# Altium project SOM Board with RK3399.PrjPcb (part 1 of 4)
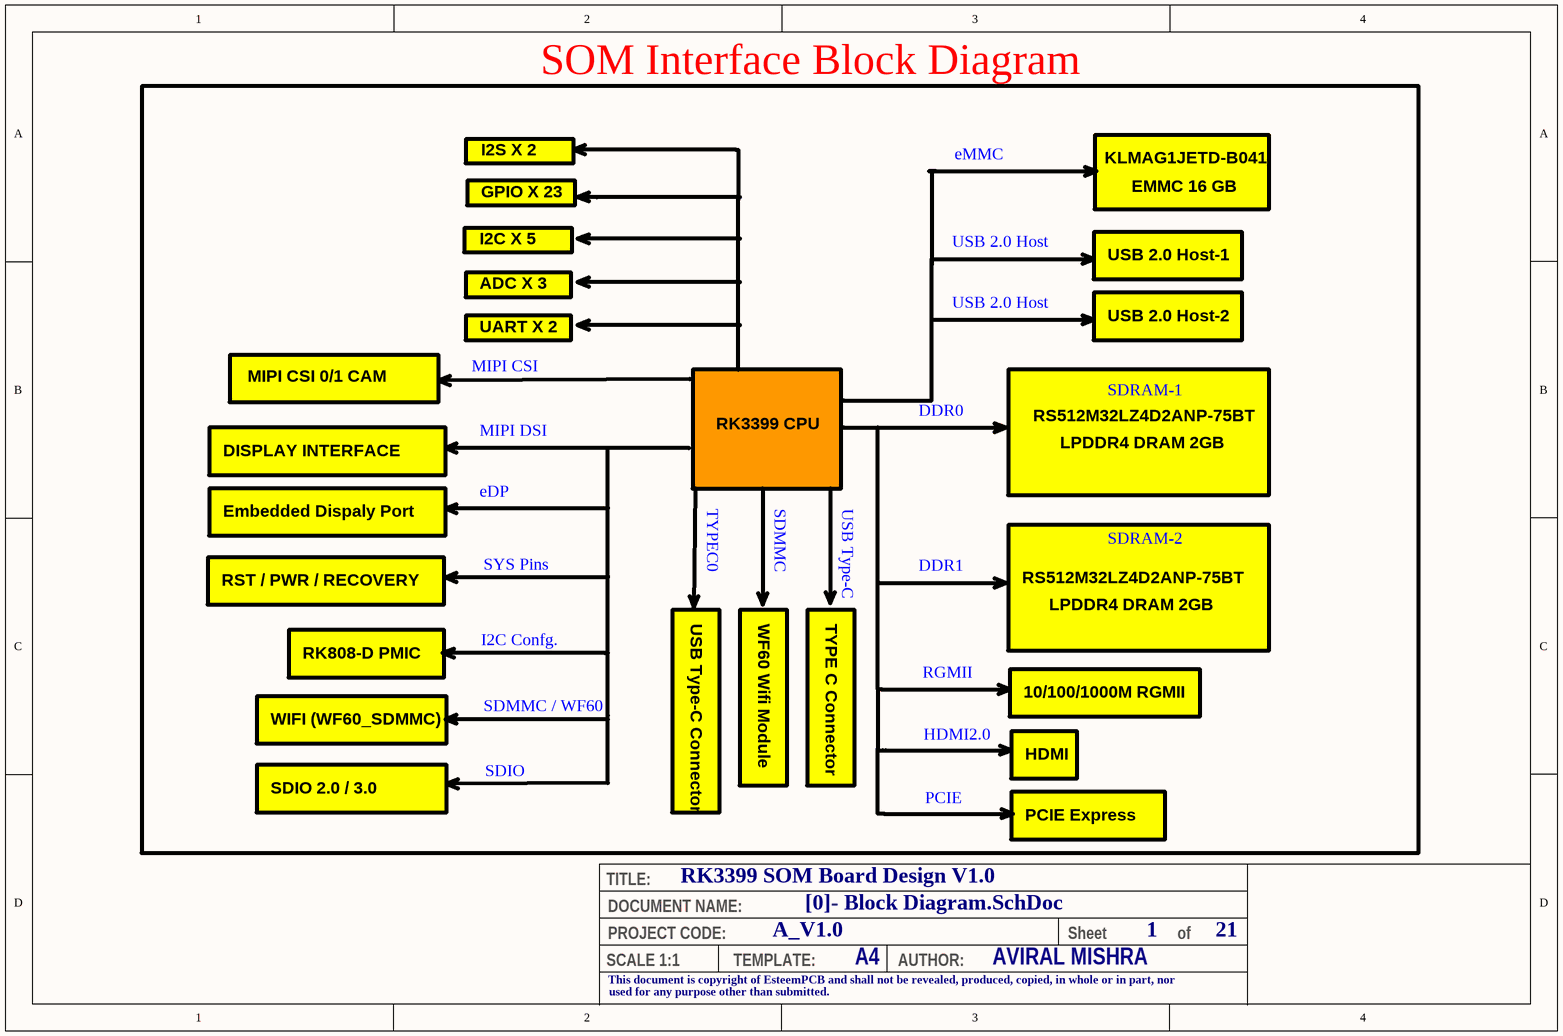
[diagram p0: [0]- Block Diagram.SchDoc]
21 sheets, 565 parts. Net scope: global (net labels, ports and power ports of the same name join across sheets).
Board file: SOM Board with RK3399.PcbDoc
Sheets:
  [0]- Block Diagram.SchDoc
  [0]-Power Blocks Diagram.SchDoc
  [1]-Power Pins Page of RK3399.SchDoc
  [2]-PMUIO_BLOCK.SchDoc
  [3]-RK3399_EMMC_ADC_PCIE.SchDoc
  [4]-RK3399 EDP_CSI_HDMI.SchDoc
  [5]-USB2, TYPEC, USIC.SchDoc
  [6]-MIPI-CSI_GPIOs and I2C.SchDoc
  [7]-RGMII_SDIO_SPI_GPIOs etc.SchDoc
  [8]-RK3399 SDRAM Page.SchDoc
  [9]-LPDDR4 SDRAM-1.SchDoc
  [10]-LPDDR4 SDRAM-2.SchDoc
  [11]-EMMC Chip.SchDoc
  [12]-WIFI Module WF60.SchDoc
  [13]-TYPEC0_PROG.SchDoc
  [14]-RGMII_PHY.SchDoc
  [15]-Push_Button_&_SYS_LED.SchDoc
  [16]-SP1_TYPEC_PWR_IN.SchDoc
  [17]-SP2_BUCKs_GPU_LOG_CPU-B.SchDoc
  [18]-SP3_PMIC_BLOCK.SchDoc
  [19]-DDR4_260_PIN_CON.SchDoc

## Sheet [0]- Block Diagram.SchDoc: RK3399 SOM Board Design V1.0
size A4; Author: AVIRAL MISHRA; DocumentNumber: 1; SheetNumber: 1; SheetTotal: 21; PROJECT CODE: A_V1.0

### Notes on the sheet
- SOM Interface Block Diagram
- I2S X 2
- eMMC
- KLMAG1JETD-B041
- I2C X 5
- GPIO X 23
- USB 2.0 Host
- EMMC 16 GB
- ADC X 3
- USB 2.0 Host-1
- MIPI CSI 0/1 CAM
- MIPI CSI
- UART X 2
- USB 2.0 Host-2
- MIPI DSI
- RK3399 CPU
- DDR0
- RS512M32LZ4D2ANP-75BT
- LPDDR4 DRAM 2GB
- SDRAM-1
- DISPLAY INTERFACE
- Embedded Dispaly Port
- eDP
- TYPEC0
- SDMMC
- USB Type-C
- RST / PWR / RECOVERY
- SYS Pins
- DDR1
- SDRAM-2
- I2C Confg.
- USB Type-C Connector
- WF60 Wifi Module
- TYPE C Connector
- RK808-D PMIC
- SDMMC / WF60
- RGMII
- 10/100/1000M RGMII
- WIFI (WF60_SDMMC)
- SDIO
- HDMI2.0
- HDMI
- SDIO 2.0 / 3.0
- PCIE
- PCIE Express
- TITLE:
- DOCUMENT NAME:
- SCALE 1:1
- This document is copyright of EsteemPCB and shall not be revealed, produced, copied, in whole or in part, nor
- PROJECT CODE:
- TEMPLATE:
- A4
- AUTHOR:
- Sheet
- of
- used for any purpose other than submitted.

## Sheet [0]-Power Blocks Diagram.SchDoc: RK3399 SOM Board Design V1.0
size A3; Author: ABC; Organization: Altium Limited; Address1: L3, 12a Rodborough Rd; Address2: Frenchs Forest; Address3: NSW; Address4: Australia 2086; DocumentNumber: 2; SheetNumber: 2; SheetTotal: 21; PROJECT CODE: A_V1.0
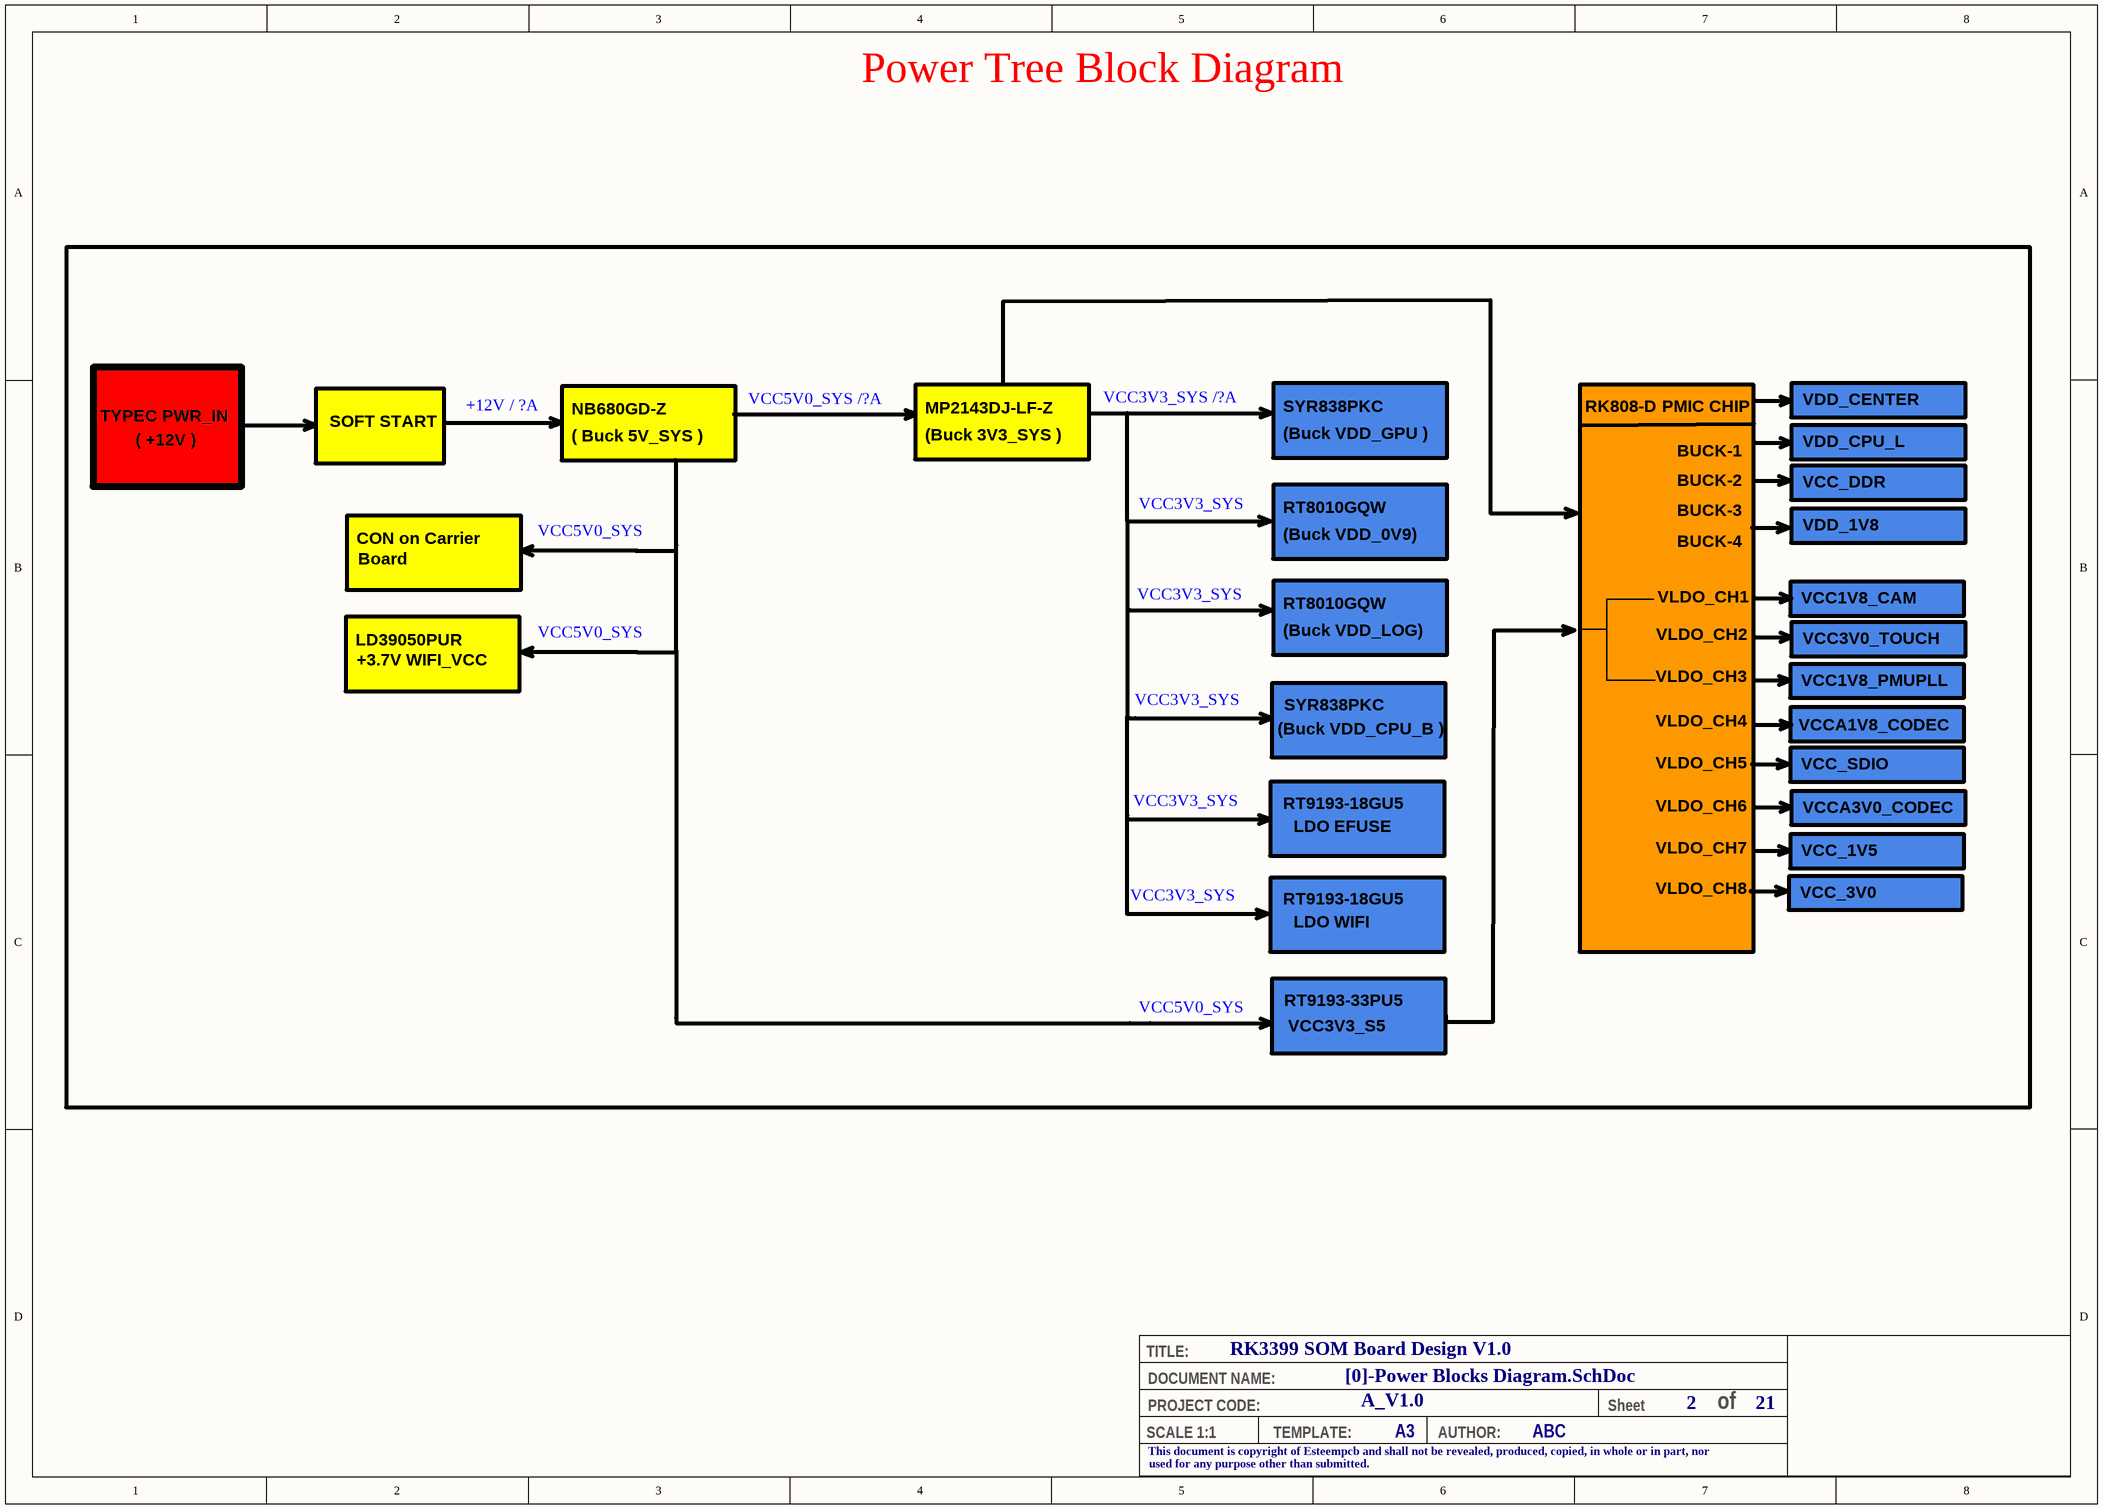
[diagram p1: [0]-Power Blocks Diagram.SchDoc]

### Notes on the sheet
- Power Tree Block Diagram
- TYPEC PWR_IN
- ( +12V )
- SOFT START
- +12V / ?A
- NB680GD-Z
- ( Buck 5V_SYS )
- VCC5V0_SYS /?A
- MP2143DJ-LF-Z
- (Buck 3V3_SYS )
- VCC3V3_SYS /?A
- SYR838PKC
- (Buck VDD_GPU )
- RK808-D
- PMIC CHIP
- VDD_CENTER
- VDD_CPU_L
- VCC3V3_SYS
- RT8010GQW
- BUCK-1
- BUCK-2
- BUCK-3
- VCC_DDR
- CON on Carrier
- Board
- VCC5V0_SYS
- (Buck VDD_0V9)
- BUCK-4
- VDD_1V8
- LD39050PUR
- (Buck VDD_LOG)
- VLDO_CH2
- VLDO_CH1
- VCC1V8_CAM
- VCC3V0_TOUCH
- +3.7V WIFI_VCC
- VLDO_CH3
- VCC1V8_PMUPLL
- (Buck VDD_CPU_B )
- VLDO_CH4
- VLDO_CH5
- VCCA1V8_CODEC
- VCC_SDIO
- RT9193-18GU5
- LDO EFUSE
- VLDO_CH6
- VLDO_CH7
- VCC_1V5
- VCCA3V0_CODEC
- VLDO_CH8
- VCC_3V0
- LDO WIFI
- RT9193-33PU5
- VCC3V3_S5
- TITLE:
- DOCUMENT NAME:
- SCALE 1:1
- This document is copyright of Esteempcb and shall not be revealed, produced, copied, in whole or in part, nor
- PROJECT CODE:
- TEMPLATE:
- A3
- AUTHOR:
- Sheet
- of
- used for any purpose other than submitted.

## Sheet [1]-Power Pins Page of RK3399.SchDoc: RK3399 SOM Board Design V1.0
size A3; Author: ABC; Organization: Altium Limited; Address1: L3, 12a Rodborough Rd; Address2: Frenchs Forest; Address3: NSW; Address4: Australia 2086; DocumentNumber: 3; SheetNumber: 3; SheetTotal: 21; PROJECT CODE: A_V1.0
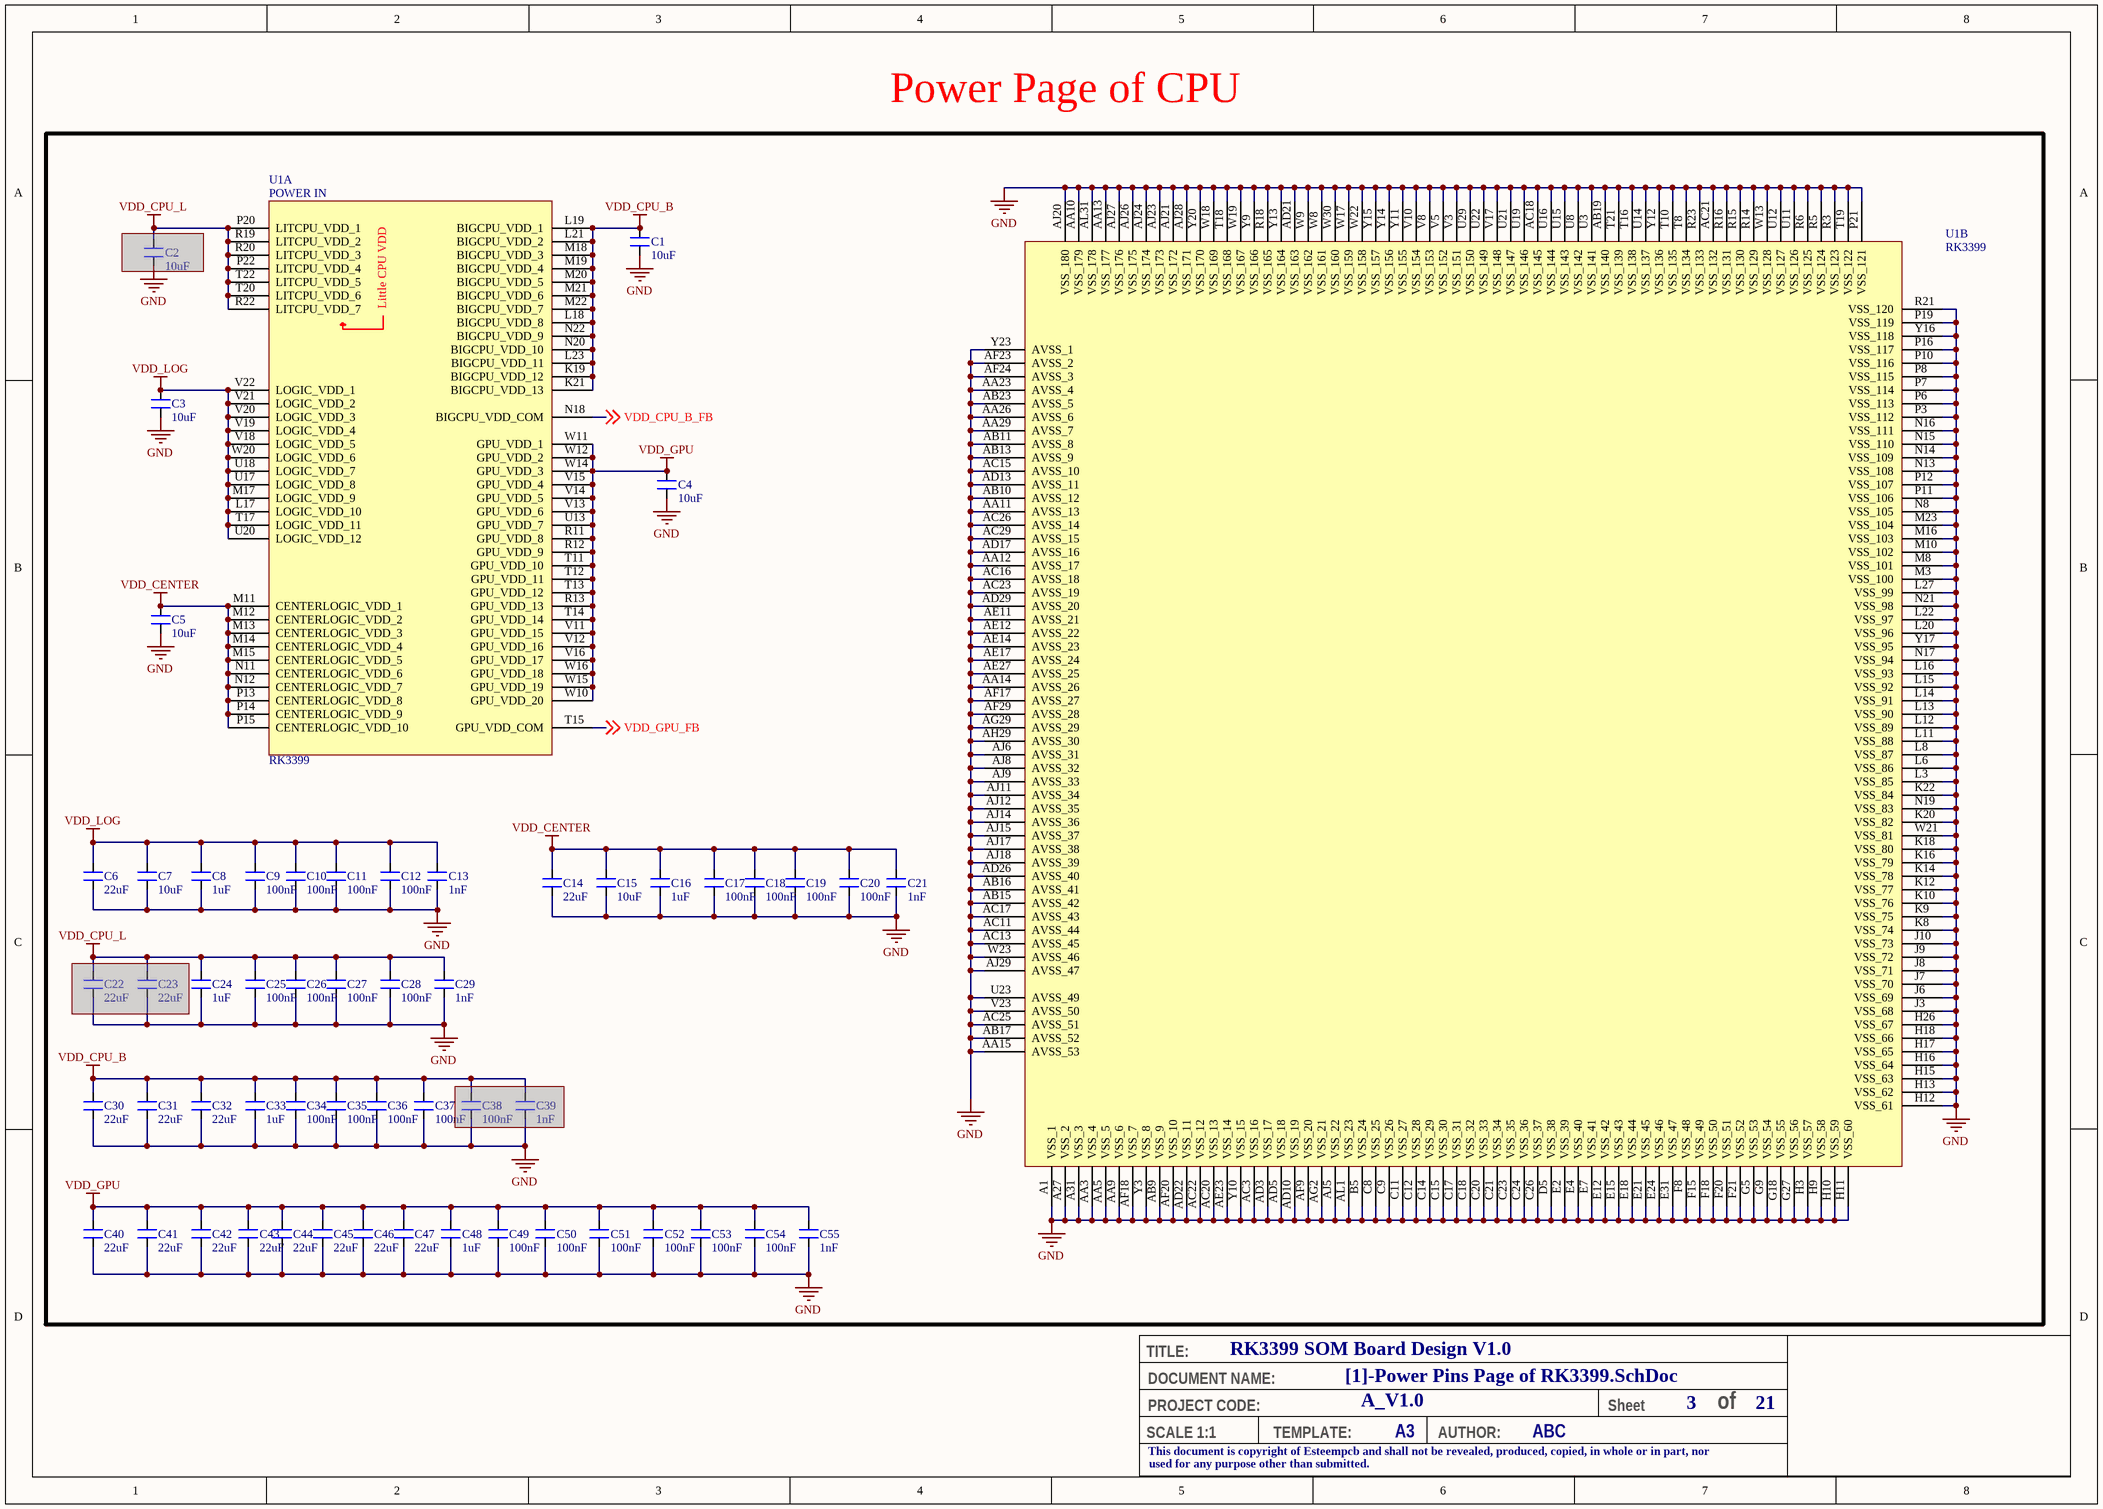
[diagram p2: [1]-Power Pins Page of RK3399.SchDoc]

### Parts
C1  10uF  [CAP_0402]
C2  10uF  [CAP_0402]  (masked out: inside a compile mask, not in the netlist)
C3  10uF  [CAP_0402]
C4  10uF  [CAP_0402]
C5  10uF  [CAP_0402]
C6  22uF  [CAP_0402]
C7  10uF  [CAP_0402]
C8  1uF  [CAP_0201]
C9  100nF  [CAP_0201]
C10  100nF  [CAP_0201]
C11  100nF  [CAP_0201]
C12  100nF  [CAP_0201]
C13  1nF  [CAP_0201]
C14  22uF  [CAP_0402]
C15  10uF  [CAP_0402]
C16  1uF  [CAP_0201]
C17  100nF  [CAP_0201]
C18  100nF  [CAP_0201]
C19  100nF  [CAP_0201]
C20  100nF  [CAP_0201]
C21  1nF  [CAP_0201]
C22  22uF  [CAP_0402]  (masked out: inside a compile mask, not in the netlist)
C23  22uF  [CAP_0402]  (masked out: inside a compile mask, not in the netlist)
C24  1uF  [CAP_0201]
C25  100nF  [CAP_0201]
C26  100nF  [CAP_0201]
C27  100nF  [CAP_0201]
C28  100nF  [CAP_0201]
C29  1nF  [CAP_0201]
C30  22uF  [CAP_0402]
C31  22uF  [CAP_0402]
C32  22uF  [CAP_0402]
C33  1uF  [CAP_0201]
C34  100nF  [CAP_0201]
C35  100nF  [CAP_0201]
C36  100nF  [CAP_0201]
C37  100nF  [CAP_0201]
C38  100nF  [CAP_0201]  (masked out: inside a compile mask, not in the netlist)
C39  1nF  [CAP_0201]  (masked out: inside a compile mask, not in the netlist)
C40  22uF  [CAP_0402]
C41  22uF  [CAP_0402]
C42  22uF  [CAP_0402]
C43  22uF  [CAP_0402]
C44  22uF  [CAP_0402]
C45  22uF  [CAP_0402]
C46  22uF  [CAP_0402]
C47  22uF  [CAP_0402]
C48  1uF  [CAP_0201]
C49  100nF  [CAP_0201]
C50  100nF  [CAP_0201]
C51  100nF  [CAP_0201]
C52  100nF  [CAP_0201]
C53  100nF  [CAP_0201]
C54  100nF  [CAP_0201]
C55  1nF  [CAP_0201]
U1  RK3399  [FBGA828_23_826X826]  (parts A,B of 24)

### Nets
GND: C1.1 C3.1 C4.1 C5.1 C6.1 C7.1 C8.1 C9.1 C10.1 C11.1 C12.1 C13.1 C14.1 C15.1 C16.1 C17.1 C18.1 C19.1 C20.1 C21.1 C24.1 C25.1 C26.1 C27.1 C28.1 C29.1 C30.1 C31.1 C32.1 C33.1 C34.1 C35.1 C36.1 C37.1 C40.1 C41.1 C42.1 C43.1 C44.1 C45.1 C46.1 C47.1 C48.1 C49.1 C50.1 C51.1 C52.1 C53.1 C54.1 C55.1 U1.A1(VSS_1) U1.A27(VSS_2) U1.A31(VSS_3) U1.AA3(VSS_4) U1.AA5(VSS_5) U1.AA9(VSS_6) U1.AA10(VSS_179) U1.AA11(AVSS_13) U1.AA12(AVSS_17) U1.AA13(VSS_177) U1.AA14(AVSS_26) U1.AA15(AVSS_53) U1.AA23(AVSS_4) U1.AA26(AVSS_6) U1.AA29(AVSS_7) U1.AB9(VSS_9) U1.AB10(AVSS_12) U1.AB11(AVSS_8) U1.AB13(AVSS_9) U1.AB15(AVSS_42) U1.AB16(AVSS_41) U1.AB17(AVSS_52) U1.AB19(VSS_140) U1.AB23(AVSS_5) U1.AC3(VSS_16) U1.AC11(AVSS_44) U1.AC13(AVSS_45) U1.AC15(AVSS_10) U1.AC16(AVSS_18) U1.AC17(AVSS_43) U1.AC18(VSS_145) U1.AC20(VSS_13) U1.AC21(VSS_132) U1.AC22(VSS_12) U1.AC23(AVSS_19) U1.AC25(AVSS_51) U1.AC26(AVSS_14) U1.AC29(AVSS_15) U1.AD3(VSS_17) U1.AD5(VSS_18) U1.AD10(VSS_19) U1.AD13(AVSS_11) U1.AD17(AVSS_16) U1.AD21(VSS_163) U1.AD22(VSS_11) U1.AD26(AVSS_40) U1.AD29(AVSS_20) U1.AE11(AVSS_21) U1.AE12(AVSS_22) U1.AE14(AVSS_23) U1.AE17(AVSS_24) U1.AE23(VSS_14) U1.AE27(AVSS_25) U1.AF9(VSS_20) U1.AF17(AVSS_27) U1.AF18(VSS_7) U1.AF20(VSS_10) U1.AF23(AVSS_2) U1.AF24(AVSS_3) U1.AF29(AVSS_28) U1.AG2(VSS_21) U1.AG29(AVSS_29) U1.AH29(AVSS_30) U1.AJ5(VSS_22) U1.AJ6(AVSS_31) U1.AJ8(AVSS_32) U1.AJ9(AVSS_33) U1.AJ11(AVSS_34) U1.AJ12(AVSS_35) U1.AJ14(AVSS_36) U1.AJ15(AVSS_37) U1.AJ17(AVSS_38) U1.AJ18(AVSS_39) U1.AJ20(VSS_180) U1.AJ21(VSS_172) U1.AJ23(VSS_173) U1.AJ24(VSS_174) U1.AJ26(VSS_175) U1.AJ27(VSS_176) U1.AJ28(VSS_171) U1.AJ29(AVSS_47) U1.AL1(VSS_23) U1.AL31(VSS_178) U1.B5(VSS_24) U1.C8(VSS_25) U1.C9(VSS_26) U1.C11(VSS_27) U1.C12(VSS_28) U1.C14(VSS_29) U1.C15(VSS_30) U1.C17(VSS_31) U1.C18(VSS_32) U1.C20(VSS_33) U1.C21(VSS_34) U1.C23(VSS_35) U1.C24(VSS_36) U1.C26(VSS_37) U1.D5(VSS_38) U1.E2(VSS_39) U1.E4(VSS_40) U1.E7(VSS_41) U1.E12(VSS_42) U1.E15(VSS_43) U1.E18(VSS_44) U1.E21(VSS_45) U1.E24(VSS_46) U1.E31(VSS_47) U1.F8(VSS_48) U1.F15(VSS_49) U1.F18(VSS_50) U1.F20(VSS_51) U1.F21(VSS_52) U1.G5(VSS_53) U1.G9(VSS_54) U1.G18(VSS_55) U1.G27(VSS_56) U1.H3(VSS_57) U1.H9(VSS_58) U1.H10(VSS_59) U1.H11(VSS_60) U1.H12(VSS_61) U1.H13(VSS_62) U1.H15(VSS_63) U1.H16(VSS_64) U1.H17(VSS_65) U1.H18(VSS_66) U1.H26(VSS_67) U1.J3(VSS_68) U1.J6(VSS_69) U1.J7(VSS_70) U1.J8(VSS_71) U1.J9(VSS_72) U1.J10(VSS_73) U1.K8(VSS_74) U1.K9(VSS_75) U1.K10(VSS_76) U1.K12(VSS_77) U1.K14(VSS_78) U1.K16(VSS_79) U1.K18(VSS_80) U1.K20(VSS_82) U1.K22(VSS_84) U1.L3(VSS_85) U1.L6(VSS_86) U1.L8(VSS_87) U1.L11(VSS_88) U1.L12(VSS_89) U1.L13(VSS_90) U1.L14(VSS_91) U1.L15(VSS_92) U1.L16(VSS_93) U1.L20(VSS_96) U1.L22(VSS_97) U1.L27(VSS_99) U1.M3(VSS_100) U1.M8(VSS_101) U1.M10(VSS_102) U1.M16(VSS_103) U1.M23(VSS_104) U1.N8(VSS_105) U1.N13(VSS_108) U1.N14(VSS_109) U1.N15(VSS_110) U1.N16(VSS_111) U1.N17(VSS_94) U1.N19(VSS_83) U1.N21(VSS_98) U1.P3(VSS_112) U1.P6(VSS_113) U1.P7(VSS_114) U1.P8(VSS_115) U1.P10(VSS_116) U1.P11(VSS_106) U1.P12(VSS_107) U1.P16(VSS_117) U1.P19(VSS_119) U1.P21(VSS_121) U1.R3(VSS_123) U1.R5(VSS_124) U1.R6(VSS_125) U1.R14(VSS_129) U1.R15(VSS_130) U1.R16(VSS_131) U1.R18(VSS_165) U1.R21(VSS_120) U1.R23(VSS_133) U1.T8(VSS_134) U1.T10(VSS_135) U1.T16(VSS_138) U1.T18(VSS_168) U1.T19(VSS_122) U1.T21(VSS_139) U1.U3(VSS_141) U1.U8(VSS_142) U1.U11(VSS_126) U1.U12(VSS_127) U1.U14(VSS_137) U1.U15(VSS_143) U1.U16(VSS_144) U1.U19(VSS_146) U1.U21(VSS_147) U1.U22(VSS_149) U1.U23(AVSS_49) U1.U29(VSS_150) U1.V3(VSS_151) U1.V5(VSS_152) U1.V8(VSS_153) U1.V10(VSS_154) U1.V17(VSS_148) U1.V23(AVSS_50) U1.W8(VSS_161) U1.W9(VSS_162) U1.W13(VSS_128) U1.W17(VSS_159) U1.W18(VSS_169) U1.W19(VSS_167) U1.W21(VSS_81) U1.W22(VSS_158) U1.W23(AVSS_46) U1.W30(VSS_160) U1.Y3(VSS_8) U1.Y9(VSS_166) U1.Y10(VSS_15) U1.Y11(VSS_155) U1.Y12(VSS_136) U1.Y13(VSS_164) U1.Y14(VSS_156) U1.Y15(VSS_157) U1.Y16(VSS_118) U1.Y17(VSS_95) U1.Y20(VSS_170) U1.Y23(AVSS_1)
VDD_CENTER: C5.2 C14.2 C15.2 C16.2 C17.2 C18.2 C19.2 C20.2 C21.2 U1.M11(CENTERLOGIC_VDD_1) U1.M12(CENTERLOGIC_VDD_2) U1.M13(CENTERLOGIC_VDD_3) U1.M14(CENTERLOGIC_VDD_4) U1.M15(CENTERLOGIC_VDD_5) U1.N11(CENTERLOGIC_VDD_6) U1.N12(CENTERLOGIC_VDD_7) U1.P13(CENTERLOGIC_VDD_8) U1.P14(CENTERLOGIC_VDD_9) U1.P15(CENTERLOGIC_VDD_10)
VDD_CPU_B: C1.2 C30.2 C31.2 C32.2 C33.2 C34.2 C35.2 C36.2 C37.2 U1.K19(BIGCPU_VDD_12) U1.K21(BIGCPU_VDD_13) U1.L18(BIGCPU_VDD_8) U1.L19(BIGCPU_VDD_1) U1.L21(BIGCPU_VDD_2) U1.L23(BIGCPU_VDD_11) U1.M18(BIGCPU_VDD_3) U1.M19(BIGCPU_VDD_4) U1.M20(BIGCPU_VDD_5) U1.M21(BIGCPU_VDD_6) U1.M22(BIGCPU_VDD_7) U1.N20(BIGCPU_VDD_10) U1.N22(BIGCPU_VDD_9)
VDD_CPU_L: C24.2 C25.2 C26.2 C27.2 C28.2 C29.2 U1.P20(LITCPU_VDD_1) U1.P22(LITCPU_VDD_4) U1.R19(LITCPU_VDD_2) U1.R20(LITCPU_VDD_3) U1.R22(LITCPU_VDD_7) U1.T20(LITCPU_VDD_6) U1.T22(LITCPU_VDD_5)
VDD_GPU: C4.2 C40.2 C41.2 C42.2 C43.2 C44.2 C45.2 C46.2 C47.2 C48.2 C49.2 C50.2 C51.2 C52.2 C53.2 C54.2 C55.2 U1.R11(GPU_VDD_8) U1.R12(GPU_VDD_9) U1.R13(GPU_VDD_13) U1.T11(GPU_VDD_10) U1.T12(GPU_VDD_11) U1.T13(GPU_VDD_12) U1.T14(GPU_VDD_14) U1.U13(GPU_VDD_7) U1.V11(GPU_VDD_15) U1.V12(GPU_VDD_16) U1.V13(GPU_VDD_6) U1.V14(GPU_VDD_5) U1.V15(GPU_VDD_4) U1.V16(GPU_VDD_17) U1.W10(GPU_VDD_20) U1.W11(GPU_VDD_1) U1.W12(GPU_VDD_2) U1.W14(GPU_VDD_3) U1.W15(GPU_VDD_19) U1.W16(GPU_VDD_18)
VDD_LOG: C3.2 C6.2 C7.2 C8.2 C9.2 C10.2 C11.2 C12.2 C13.2 U1.L17(LOGIC_VDD_10) U1.M17(LOGIC_VDD_9) U1.T17(LOGIC_VDD_11) U1.U17(LOGIC_VDD_8) U1.U18(LOGIC_VDD_7) U1.U20(LOGIC_VDD_12) U1.V18(LOGIC_VDD_5) U1.V19(LOGIC_VDD_4) U1.V20(LOGIC_VDD_3) U1.V21(LOGIC_VDD_2) U1.V22(LOGIC_VDD_1) U1.W20(LOGIC_VDD_6)
VDD_CPU_B_FB: U1.N18(BIGCPU_VDD_COM) ; off-sheet VDD_CPU_B_FB
VDD_GPU_FB: U1.T15(GPU_VDD_COM) ; off-sheet VDD_GPU_FB

### Notes on the sheet
- Power Page of CPU
- TITLE:
- DOCUMENT NAME:
- SCALE 1:1
- This document is copyright of Esteempcb and shall not be revealed, produced, copied, in whole or in part, nor
- PROJECT CODE:
- TEMPLATE:
- A3
- AUTHOR:
- Sheet
- of
- used for any purpose other than submitted.
- (in symbol IC_RK3399-FCBGA828, part A) POWER IN; Little CPU VDD

### Library data of the parts
C1-C5 C7 C15 = CAP_10uF-10V-20%-0402: 10µF ±20% 10V Ceramic Capacitor X5R 0402 (1005 Metric) /; Manufacturer Part Number: CL05A106MP5NUNC; Manufacturer: Samsung Electro-Mechanics; Case/Package: 0402; Supplier-1: Digikey
C6 C14 C22 C23 C30-C32 C40-C47 = CAP_22uF-6.3V-20%-0402: 22µF ±20% 6.3V Ceramic Capacitor X5R 0402 (1005 Metric) /; Manufacturer: Murata Electronics; Manufacturer Part Number: CL05A226MQ5N6J8; Case/Package: 0402; Supplier-1: Digikey
C8 C16 C24 C33 C48 = CAP_1uF-16V-10%-0201: 1µF ±20% 16V Ceramic Capacitor X5R 0201 (0603 Metric) /; Manufacturer: Samsung Electro-Mechanics; Manufacturer Part Number: CL03A105MO3NRNH; Case/Package: 0201; Supplier-1: Digikey
C9-C12 C17-C20 C25-C28 C34-C38 C49-C54 = CAP_100nF-25V-10%-0201: 0.1µF ±10% 25V Ceramic Capacitor X5R 0201 (0603 Metric) /; Manufacturer: TDK Corporation; Manufacturer Part Number: C0603X5R1E104K030BB; Case/Package: 0201; Supplier-1: Digikey
C13 C21 C29 C39 C55 = CAP_1nF-16V-10%-0201: 1000pF ±10% 16V Ceramic Capacitor X7R 0201 (0603 Metric) /; Manufacturer: Murata Electronics; Manufacturer Part Number: GRM033R71C102KA01D; Case/Package: 0201; Supplier-1: Digikey
U1 = IC_RK3399-FCBGA828: RK3399 is a low power, high performance processor for computing, personal mobile.; Manufacturer: Rockchip; Manufacturer Part Number: RK3399; Case/Package: FCBGA828; Supplier-1: Rockchip

## Sheet [2]-PMUIO_BLOCK.SchDoc: RK3399 SOM Board Design V1.0
size A4; Author: AVIRAL MISHRA; DocumentNumber: 4; SheetNumber: 4; SheetTotal: 21; PROJECT CODE: A_V1.0
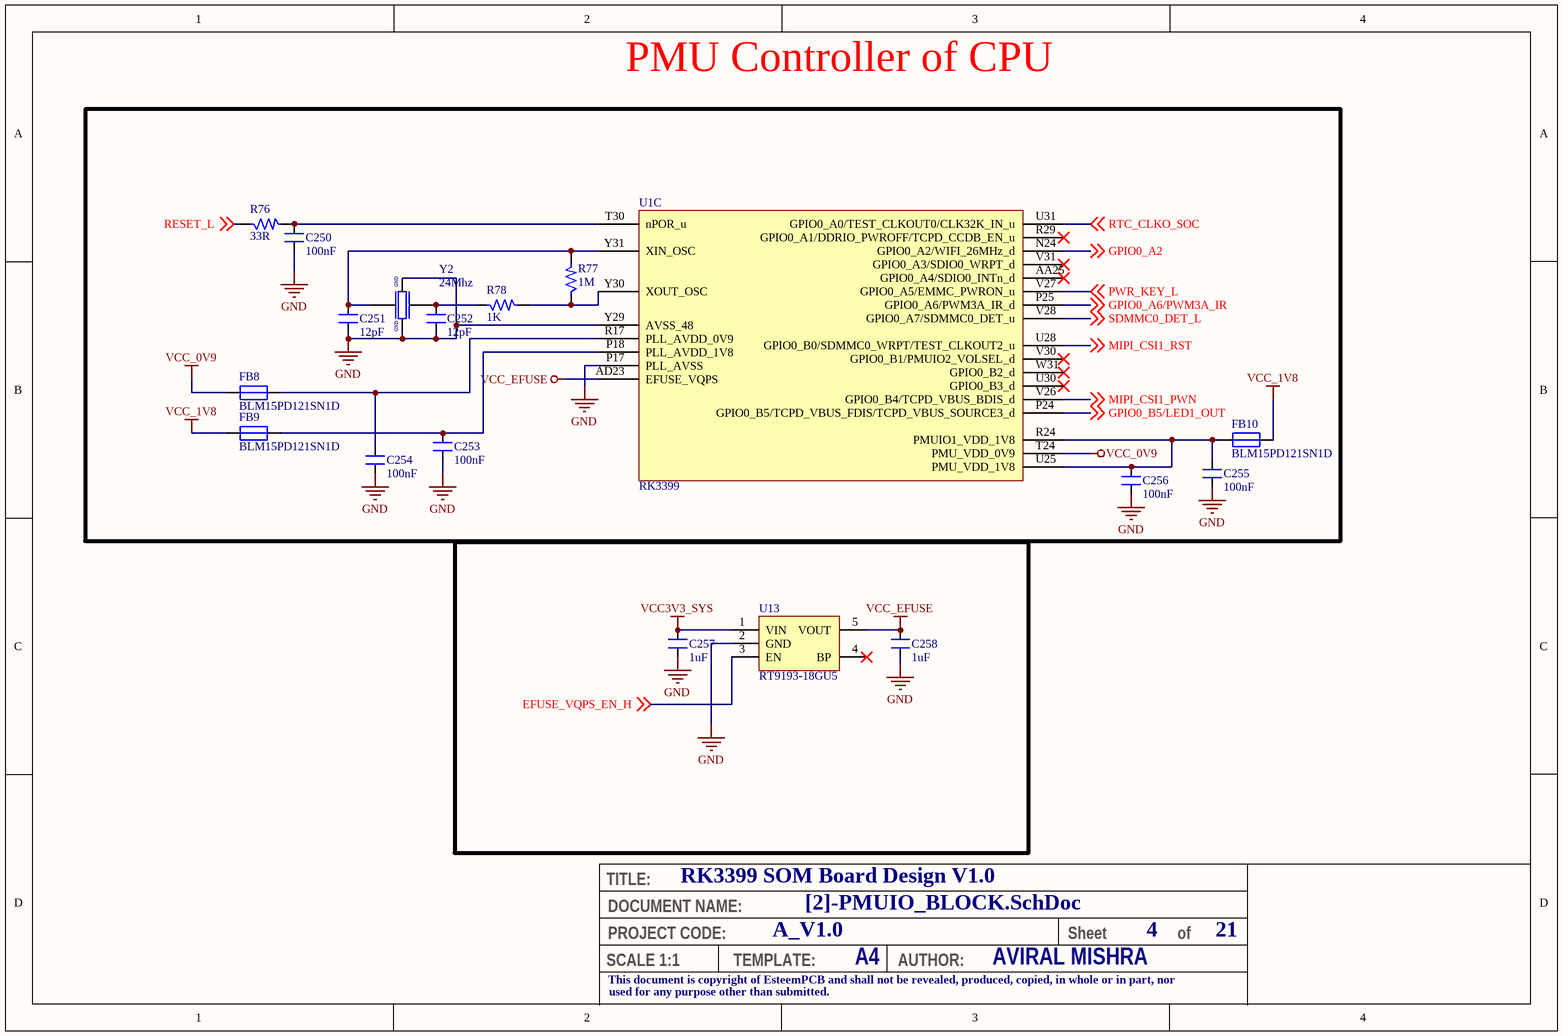
[diagram p3: [2]-PMUIO_BLOCK.SchDoc]

### Parts
C250  100nF  [CAP_0201]
C251  12pF  [CAP_0201]
C252  12pF  [CAP_0201]
C253  100nF  [CAP_0201]
C254  100nF  [CAP_0201]
C255  100nF  [CAP_0201]
C256  100nF  [CAP_0201]
C257  1uF  [CAP_0201]
C258  1uF  [CAP_0201]
FB8  BLM15PD121SN1D  [RES_0402]
FB9  BLM15PD121SN1D  [RES_0402]
FB10  BLM15PD121SN1D  [RES_0402]
R76  33R  [RES_0201]
R77  1M  [RES_0201]
R78  1K  [RES_0201]
U1  RK3399  [FBGA828_23_826X826]  (part C of 24)
U13  RT9193-18GU5  [SC70-5]
Y2  24Mhz  [XTAL_ABM8AIG-24.000MHZ-12-2Z-T3]

### Nets
GND: C250.1 C251.1 C252.1 C253.1 C254.1 C255.1 C256.1 C257.1 C258.1 U1.P17(PLL_AVSS) U1.Y29(AVSS_48) U13.2(GND) Y2.2 Y2.4
VCC3V3_SYS: C257.2 U13.1(VIN)
VCC_0V9: FB8.1 U1.T24(PMU_VDD_0V9)
VCC_1V8: FB9.1 FB10.2
VCC_EFUSE: C258.2 U1.AD23(EFUSE_VQPS) U13.5(VOUT)
EFUSE_VQPS_EN_H: U13.3(EN) ; off-sheet EFUSE_VQPS_EN_H
GPIO0_A2: U1.N24(GPIO0_A2/WIFI_26MHz_d) ; off-sheet GPIO0_A2
GPIO0_A6/PWM3A_IR: U1.P25(GPIO0_A6/PWM3A_IR_d) ; off-sheet GPIO0_A6/PWM3A_IR
GPIO0_B5/LED1_OUT: U1.P24(GPIO0_B5/TCPD_VBUS_FDIS/TCPD_VBUS_SOURCE3_d) ; off-sheet GPIO0_B5/LED1_OUT
MIPI_CSI1_PWN: U1.V26(GPIO0_B4/TCPD_VBUS_BDIS_d) ; off-sheet MIPI_CSI1_PWN
MIPI_CSI1_RST: U1.U28(GPIO0_B0/SDMMC0_WRPT/TEST_CLKOUT2_u) ; off-sheet MIPI_CSI1_RST
PWR_KEY_L: U1.V27(GPIO0_A5/EMMC_PWRON_u) ; off-sheet PWR_KEY_L
RESET_L: R76.1 ; off-sheet RESET_L
RTC_CLKO_SOC: U1.U31(GPIO0_A0/TEST_CLKOUT0/CLK32K_IN_u) ; off-sheet RTC_CLKO_SOC
SDMMC0_DET_L: U1.V28(GPIO0_A7/SDMMC0_DET_u) ; off-sheet SDMMC0_DET_L
NetC250_2: C250.2 R76.2 U1.T30(nPOR_u)
NetC251_2: C251.2 R77.2 U1.Y31(XIN_OSC) Y2.1
NetC252_2: C252.2 R78.1 Y2.3
NetC253_2: C253.2 FB9.2 U1.P18(PLL_AVDD_1V8)
NetC254_2: C254.2 FB8.2 U1.R17(PLL_AVDD_0V9)
NetC255_2: C255.2 C256.2 FB10.1 U1.R24(PMUIO1_VDD_1V8) U1.U25(PMU_VDD_1V8)
NetR77_1: R77.1 R78.2 U1.Y30(XOUT_OSC)

Not connected (* = marked no-connect by the designer): U1 AA25(GPIO0_A4/SDIO0_INTn_d)* R29(GPIO0_A1/DDRIO_PWROFF/TCPD_CCDB_EN_u)* U30(GPIO0_B3_d)* V30(GPIO0_B1/PMUIO2_VOLSEL_d)* V31(GPIO0_A3/SDIO0_WRPT_d)* W31(GPIO0_B2_d)*; U13 4(BP)*

### Notes on the sheet
- PMU Controller of CPU
- TITLE:
- DOCUMENT NAME:
- SCALE 1:1
- This document is copyright of EsteemPCB and shall not be revealed, produced, copied, in whole or in part, nor
- PROJECT CODE:
- TEMPLATE:
- A4
- AUTHOR:
- Sheet
- of
- used for any purpose other than submitted.
- (in symbol XTAL_24Mhz-12pF-4-SMD) GND

### Library data of the parts
C250 C253-C256 = CAP_100nF-25V-10%-0201: as C9 on sheet [1]-Power Pins Page of RK3399; Case/Package: 0201; Supplier-1: Digikey
C251 C252 = CAP_12pF-16V-10%-0201: 12pF ±10% 16V Ceramic Capacitor C0G, NP0 0201 (0603 Metric) /; Manufacturer: AVX Corporation; Manufacturer Part Number: 0201YA120KAT2A; Case/Package: 0201; Supplier-1: Digikey
C257 C258 = CAP_1uF-16V-10%-0201: as C8 on sheet [1]-Power Pins Page of RK3399; Case/Package: 0201; Supplier-1: Digikey
FB8-FB10 = FB_120R-1.3A-100Mhz-0402: 120 Ohms @ 100MHz 1 Power Line Ferrite Bead 0402 (1005 Metric) 1.3A 90mOhm; Manufacturer: Murata Electronics; Mnaufacturer Part Number: BLM15PD121SN1D; Case/Package: 0402; Supplier-1: Digikey
R76 = RES_33R-0.05W-1%-0201: 33 Ohms ±1% 0.05W, 1/20W Chip Resistor 0201 (0603 Metric) Thick Film /; Manufacturer: Yageo; Manufacturer Part Number: RC0201FR-0733RL; Case/Package: 0201; Supplier-1: Digikey
R77 = RES_1M-0.05W-1%-0201: 1 MOhms ±1% 0.05W, 1/20W Chip Resistor 0201 (0603 Metric) Thick Film /; Manufacturer: Yageo; Manufacturer Part Number: RC0201FR-071ML; Case/Package: 0201; Supplier-1: Digikey
R78 = RES_1K-0.05W-1%-0201: 1 kOhms ±1% 0.05W, 1/20W Chip Resistor 0201 (0603 Metric) Thick Film /; Manufacturer: Yageo; Manufacturer Part Number: RC0201FR-071KL; Case/Package: 0201; Supplier-1: Digikey
U1 = IC_RK3399-FCBGA828: as U1 on sheet [1]-Power Pins Page of RK3399; Manufacturer Part Number: RK3399; Case/Package: FCBGA828; Supplier-1: Rockchip
U13 = REG_1.8V-300mA-5.5V-SC70-5: Linear Voltage Regulator IC 1 Output 300mA SC-70-5; Manufacturer: Richtek USA Inc.; Manufacturer Part Number: RT9193-18GU5; Case/Package: SC70-5; Supplier-1: Digikey
Y2 = XTAL_24Mhz-12pF-4-SMD: 24MHz ±20ppm Crystal 12pF 50 Ohms 4-SMD, No Lead /; Manufacturer: Abracon LLC; Manufacturer Part Number: ABM8AIG-24.000MHZ-12-2Z-T3; Case/Package: SMD; Supplier-1: Digikey

## Sheet [3]-RK3399_EMMC_ADC_PCIE.SchDoc: RK3399 SOM Board Design V1.0
size A4; Author: AVIRAL MISHRA; DocumentNumber: 5; SheetNumber: 5; SheetTotal: 21; PROJECT CODE: A_V1.0
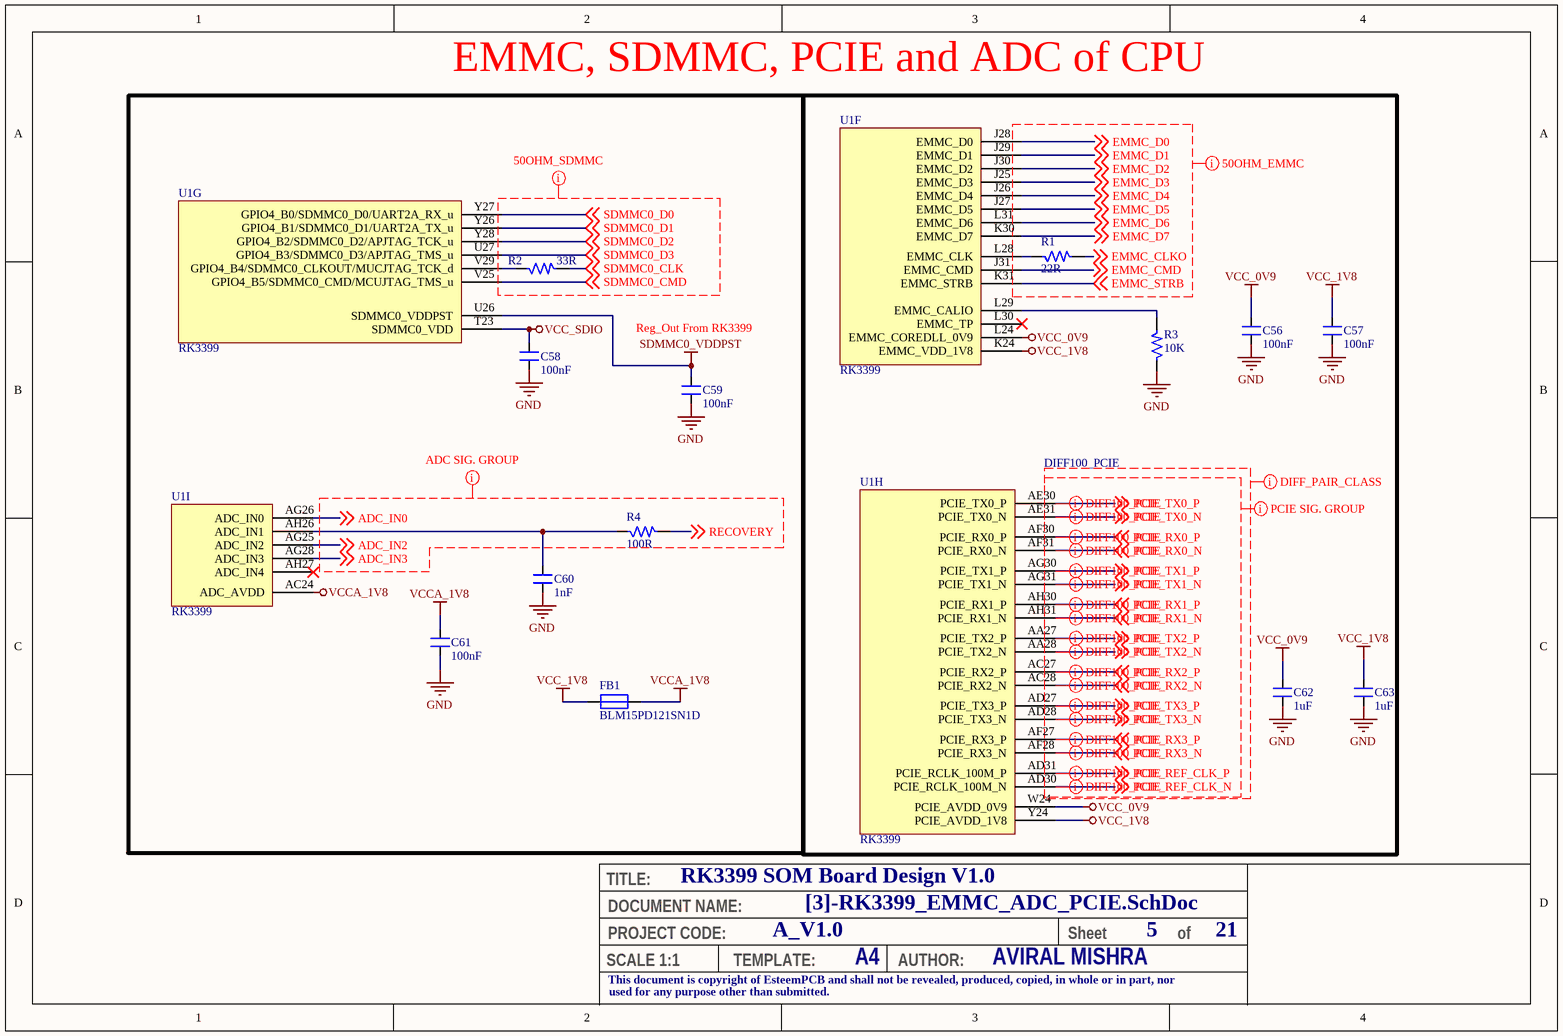
[diagram p4: [3]-RK3399_EMMC_ADC_PCIE.SchDoc]

### Parts
C56  100nF  [CAP_0201]
C57  100nF  [CAP_0201]
C58  100nF  [CAP_0201]
C59  100nF  [CAP_0201]
C60  1nF  [CAP_0201]
C61  100nF  [CAP_0201]
C62  1uF  [CAP_0201]
C63  1uF  [CAP_0201]
FB1  BLM15PD121SN1D  [RES_0402]
R1  22R  [RES_0201]
R2  33R  [RES_0201]
R3  10K  [RES_0201]
R4  100R  [RES_0201]
U1  RK3399  [FBGA828_23_826X826]  (parts F,G,H,I of 24)

### Blocks framed on the sheet
EMMC, SDMMC, PCIE and ADC of CPU: C58-C61 FB1 R2 R4 U1

### Nets
GND: C56.1 C57.1 C58.1 C59.1 C60.1 C61.1 C62.1 C63.1 R3.1
SDMMC0_VDDPST: C59.2 U1.U26(SDMMC0_VDDPST)
VCC_0V9: C56.2 C62.2 U1.L24(EMMC_COREDLL_0V9) U1.W24(PCIE_AVDD_0V9)
VCC_1V8: C57.2 C63.2 FB1.1 U1.K24(EMMC_VDD_1V8) U1.Y24(PCIE_AVDD_1V8)
VCC_SDIO: C58.2 U1.T23(SDMMC0_VDD)
VCCA_1V8: C61.2 FB1.2 U1.AC24(ADC_AVDD)
ADC_IN0: U1.AG26(ADC_IN0) ; off-sheet ADC_IN0
ADC_IN2: U1.AG25(ADC_IN2) ; off-sheet ADC_IN2
ADC_IN3: U1.AG28(ADC_IN3) ; off-sheet ADC_IN3
EMMC_CLKO: R1.2 ; off-sheet EMMC_CLKO
EMMC_CMD: U1.J31(EMMC_CMD) ; off-sheet EMMC_CMD
EMMC_D0: U1.J28(EMMC_D0) ; off-sheet EMMC_D0
EMMC_D1: U1.J29(EMMC_D1) ; off-sheet EMMC_D1
EMMC_D2: U1.J30(EMMC_D2) ; off-sheet EMMC_D2
EMMC_D3: U1.J25(EMMC_D3) ; off-sheet EMMC_D3
EMMC_D4: U1.J26(EMMC_D4) ; off-sheet EMMC_D4
EMMC_D5: U1.J27(EMMC_D5) ; off-sheet EMMC_D5
EMMC_D6: U1.L31(EMMC_D6) ; off-sheet EMMC_D6
EMMC_D7: U1.K30(EMMC_D7) ; off-sheet EMMC_D7
EMMC_STRB: U1.K31(EMMC_STRB) ; off-sheet EMMC_STRB
PCIE_REF_CLK_N: U1.AD30(PCIE_RCLK_100M_N) ; off-sheet PCIE_REF_CLK_N
PCIE_REF_CLK_P: U1.AD31(PCIE_RCLK_100M_P) ; off-sheet PCIE_REF_CLK_P
PCIE_RX0_N: U1.AF31(PCIE_RX0_N) ; off-sheet PCIE_RX0_N
PCIE_RX0_P: U1.AF30(PCIE_RX0_P) ; off-sheet PCIE_RX0_P
PCIE_RX1_N: U1.AH31(PCIE_RX1_N) ; off-sheet PCIE_RX1_N
PCIE_RX1_P: U1.AH30(PCIE_RX1_P) ; off-sheet PCIE_RX1_P
PCIE_RX2_N: U1.AC28(PCIE_RX2_N) ; off-sheet PCIE_RX2_N
PCIE_RX2_P: U1.AC27(PCIE_RX2_P) ; off-sheet PCIE_RX2_P
PCIE_RX3_N: U1.AF28(PCIE_RX3_N) ; off-sheet PCIE_RX3_N
PCIE_RX3_P: U1.AF27(PCIE_RX3_P) ; off-sheet PCIE_RX3_P
PCIE_TX0_N: U1.AE31(PCIE_TX0_N) ; off-sheet PCIE_TX0_N
PCIE_TX0_P: U1.AE30(PCIE_TX0_P) ; off-sheet PCIE_TX0_P
PCIE_TX1_N: U1.AG31(PCIE_TX1_N) ; off-sheet PCIE_TX1_N
PCIE_TX1_P: U1.AG30(PCIE_TX1_P) ; off-sheet PCIE_TX1_P
PCIE_TX2_N: U1.AA28(PCIE_TX2_N) ; off-sheet PCIE_TX2_N
PCIE_TX2_P: U1.AA27(PCIE_TX2_P) ; off-sheet PCIE_TX2_P
PCIE_TX3_N: U1.AD28(PCIE_TX3_N) ; off-sheet PCIE_TX3_N
PCIE_TX3_P: U1.AD27(PCIE_TX3_P) ; off-sheet PCIE_TX3_P
RECOVERY: R4.2 ; off-sheet RECOVERY
SDMMC0_CLK: R2.2 ; off-sheet SDMMC0_CLK
SDMMC0_CMD: U1.V25(GPIO4_B5/SDMMC0_CMD/MCUJTAG_TMS_u) ; off-sheet SDMMC0_CMD
SDMMC0_D0: U1.Y27(GPIO4_B0/SDMMC0_D0/UART2A_RX_u) ; off-sheet SDMMC0_D0
SDMMC0_D1: U1.Y26(GPIO4_B1/SDMMC0_D1/UART2A_TX_u) ; off-sheet SDMMC0_D1
SDMMC0_D2: U1.Y28(GPIO4_B2/SDMMC0_D2/APJTAG_TCK_u) ; off-sheet SDMMC0_D2
SDMMC0_D3: U1.U27(GPIO4_B3/SDMMC0_D3/APJTAG_TMS_u) ; off-sheet SDMMC0_D3
NetC60_2: C60.2 R4.1 U1.AH26(ADC_IN1)
NetR1_1: R1.1 U1.L28(EMMC_CLK)
NetR2_1: R2.1 U1.V29(GPIO4_B4/SDMMC0_CLKOUT/MUCJTAG_TCK_d)
NetR3_2: R3.2 U1.L29(EMMC_CALIO)

Not connected (* = marked no-connect by the designer): U1 AH27(ADC_IN4)* L30(EMMC_TP)*

### Layout directives
net class 50OHM_SDMMC: SDMMC0_CLK, SDMMC0_CMD, SDMMC0_D0, SDMMC0_D1, SDMMC0_D2, SDMMC0_D3
net class 50OHM_EMMC: EMMC_CLKO, EMMC_CMD, EMMC_D0, EMMC_D1, EMMC_D2, EMMC_D3, EMMC_D4, EMMC_D5, EMMC_D6, EMMC_D7, EMMC_STRB
net class PCIE SIG. GROUP: PCIE_REF_CLK_N, PCIE_REF_CLK_P, PCIE_RX0_N, PCIE_RX0_P, PCIE_RX1_N, PCIE_RX1_P, PCIE_RX2_N, PCIE_RX2_P, PCIE_RX3_N, PCIE_RX3_P, PCIE_TX0_N, PCIE_TX0_P, PCIE_TX1_N, PCIE_TX1_P, PCIE_TX2_N, PCIE_TX2_P, PCIE_TX3_N, PCIE_TX3_P
net class ADC SIG. GROUP: ADC_IN0, ADC_IN2, ADC_IN3, RECOVERY
differential pair; differential pair class DIFF100_PCIE: PCIE_REF_CLK_N, PCIE_REF_CLK_P, PCIE_RX0_N, PCIE_RX0_P, PCIE_RX1_N, PCIE_RX1_P, PCIE_RX2_N, PCIE_RX2_P, PCIE_RX3_N, PCIE_RX3_P, PCIE_TX0_N, PCIE_TX0_P, PCIE_TX1_N, PCIE_TX1_P, PCIE_TX2_N, PCIE_TX2_P, PCIE_TX3_N, PCIE_TX3_P
net class DIFF_PAIR_CLASS: PCIE_REF_CLK_N, PCIE_REF_CLK_P, PCIE_RX0_N, PCIE_RX0_P, PCIE_RX1_N, PCIE_RX1_P, PCIE_RX2_N, PCIE_RX2_P, PCIE_RX3_N, PCIE_RX3_P, PCIE_TX0_N, PCIE_TX0_P, PCIE_TX1_N, PCIE_TX1_P, PCIE_TX2_N, PCIE_TX2_P, PCIE_TX3_N, PCIE_TX3_P

### Notes on the sheet
- (near C59) Reg_Out From RK3399
- TITLE:
- DOCUMENT NAME:
- SCALE 1:1
- This document is copyright of EsteemPCB and shall not be revealed, produced, copied, in whole or in part, nor
- PROJECT CODE:
- TEMPLATE:
- A4
- AUTHOR:
- Sheet
- of
- used for any purpose other than submitted.

### Library data of the parts
C56-C59 C61 = CAP_100nF-25V-10%-0201: as C9 on sheet [1]-Power Pins Page of RK3399; Case/Package: 0201; Supplier-1: Digikey
C60 = CAP_1nF-16V-10%-0201: as C13 on sheet [1]-Power Pins Page of RK3399; Case/Package: 0201; Supplier-1: Digikey
C62 C63 = CAP_1uF-16V-10%-0201: as C8 on sheet [1]-Power Pins Page of RK3399; Case/Package: 0201; Supplier-1: Digikey
FB1 = FB_120R-1.3A-100Mhz-0402: as FB8 on sheet [2]-PMUIO_BLOCK; Mnaufacturer Part Number: BLM15PD121SN1D; Case/Package: 0402; Supplier-1: Digikey
R1 = RES_22R-0.05W-1%-0201: 22 Ohms ±1% 0.05W, 1/20W Chip Resistor 0201 (0603 Metric) Moisture Resistant Thick Film /; Manufacturer: Yageo; Manufacturer Part Number: RC0201FR-0722RL; Case/Package: 0201; Supplier-1: Digikey
R2 = RES_33R-0.05W-1%-0201: as R76 on sheet [2]-PMUIO_BLOCK; Case/Package: 0201; Supplier-1: Digikey
R3 = RES_10K-0.05W-1%-0201: 10 kOhms ±1% 0.05W, 1/20W Chip Resistor 0201 (0603 Metric) Thick Film /; Manufacturer: Stackpole Electronics Inc; Manufacturer Part Number: RMCF0201FT10K0; Case/Package: 0201; Supplier-1: Digikey
R4 = RES_100R-0.05W-1%-0201: 100 kOhms ±1% 0.05W, 1/20W Chip Resistor 0201 (0603 Metric) Automotive AEC-Q200 Thick Film /; Manufacturer: Panasonic Electronic Components; Manufacturer Part Number: ERJ-1GNF1003C; Case/Package: 0201; Supplier-1: Digikey
U1 = IC_RK3399-FCBGA828: as U1 on sheet [1]-Power Pins Page of RK3399; Manufacturer Part Number: RK3399; Case/Package: FCBGA828; Supplier-1: Rockchip

## Sheet [4]-RK3399 EDP_CSI_HDMI.SchDoc: RK3399 SOM Board Design V1.0
size A4; Author: AVIRAL MISHRA; DocumentNumber: 6; SheetNumber: 6; SheetTotal: 21; PROJECT CODE: A_V1.0
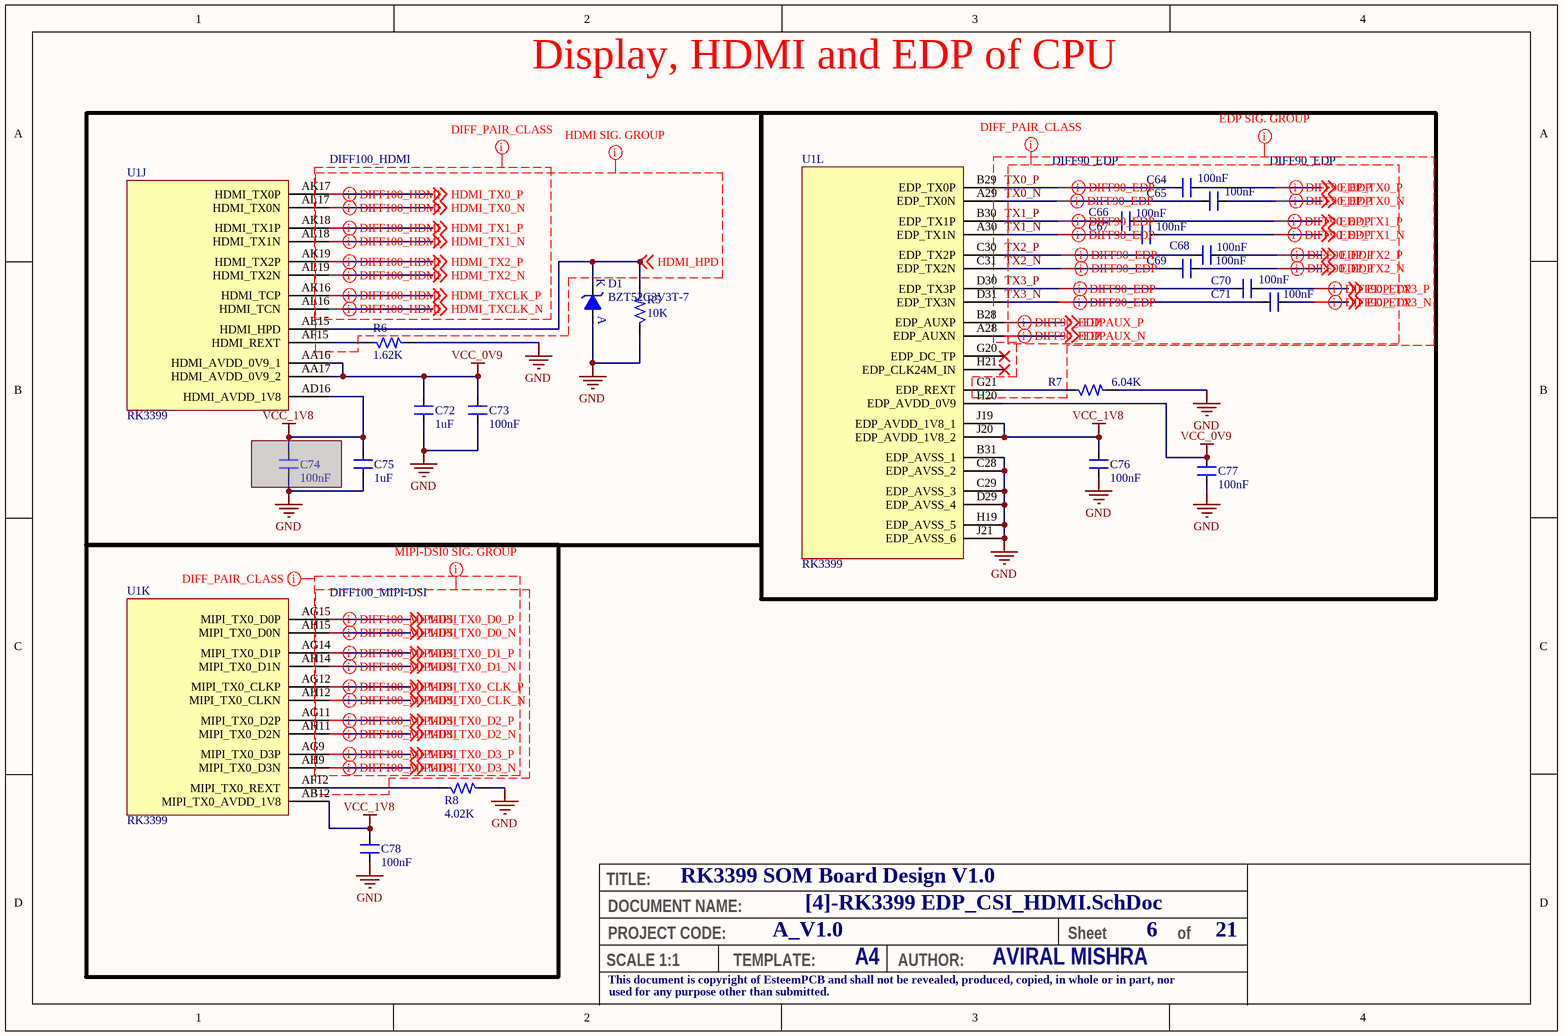
[diagram p5: [4]-RK3399 EDP_CSI_HDMI.SchDoc]

### Parts
C64  100nF  [CAP_0201]
C65  100nF  [CAP_0201]
C66  100nF  [CAP_0201]
C67  100nF  [CAP_0201]
C68  100nF  [CAP_0201]
C69  100nF  [CAP_0201]
C70  100nF  [CAP_0201]
C71  100nF  [CAP_0201]
C72  1uF  [CAP_0201]
C73  100nF  [CAP_0201]
C74  100nF  [CAP_0201]  (masked out: inside a compile mask, not in the netlist)
C75  1uF  [CAP_0201]
C76  100nF  [CAP_0201]
C77  100nF  [CAP_0201]
C78  100nF  [CAP_0201]
D1  BZT52C3V3T-7  [DIO_SOD523]
R5  10K  [RES_0201]
R6  1.62K  [RES_0201]
R7  6.04K  [RES_0201]
R8  4.02K  [RES_0201]
U1  RK3399  [FBGA828_23_826X826]  (parts J,K,L of 24)

### Nets
GND: C72.1 C73.1 C75.1 C76.2 C77.1 C78.1 D1.A R5.1 R6.2 R7.2 R8.2 U1.B31(EDP_AVSS_1) U1.C28(EDP_AVSS_2) U1.C29(EDP_AVSS_3) U1.D29(EDP_AVSS_4) U1.H19(EDP_AVSS_5) U1.J21(EDP_AVSS_6)
VCC_0V9: C72.2 C73.2 C77.2 U1.AA16(HDMI_AVDD_0V9_1) U1.AA17(HDMI_AVDD_0V9_2) U1.H20(EDP_AVDD_0V9)
VCC_1V8: C75.2 C76.1 C78.2 U1.AB12(MIPI_TX0_AVDD_1V8) U1.AD16(HDMI_AVDD_1V8) U1.J19(EDP_AVDD_1V8_1) U1.J20(EDP_AVDD_1V8_2)
EDP_TX0_N: C65.1 ; off-sheet EDP_TX0_N
EDP_TX0_P: C64.1 ; off-sheet EDP_TX0_P
EDP_TX1_N: C67.1 ; off-sheet EDP_TX1_N
EDP_TX1_P: C66.1 ; off-sheet EDP_TX1_P
EDP_TX2_N: C69.1 ; off-sheet EDP_TX2_N
EDP_TX2_P: C68.1 ; off-sheet EDP_TX2_P
EDP_TX3_N: C71.1 ; off-sheet EDP_TX3_N
EDP_TX3_P: C70.1 ; off-sheet EDP_TX3_P
EDPAUX_N: U1.A28(EDP_AUXN) ; off-sheet EDPAUX_N
EDPAUX_P: U1.B28(EDP_AUXP) ; off-sheet EDPAUX_P
HDMI_HPD: D1.K R5.2 U1.AE15(HDMI_HPD) ; off-sheet HDMI_HPD
HDMI_TX0_N: U1.AL17(HDMI_TX0N) ; off-sheet HDMI_TX0_N
HDMI_TX0_P: U1.AK17(HDMI_TX0P) ; off-sheet HDMI_TX0_P
HDMI_TX1_N: U1.AL18(HDMI_TX1N) ; off-sheet HDMI_TX1_N
HDMI_TX1_P: U1.AK18(HDMI_TX1P) ; off-sheet HDMI_TX1_P
HDMI_TX2_N: U1.AL19(HDMI_TX2N) ; off-sheet HDMI_TX2_N
HDMI_TX2_P: U1.AK19(HDMI_TX2P) ; off-sheet HDMI_TX2_P
HDMI_TXCLK_N: U1.AL16(HDMI_TCN) ; off-sheet HDMI_TXCLK_N
HDMI_TXCLK_P: U1.AK16(HDMI_TCP) ; off-sheet HDMI_TXCLK_P
MIPI_TX0_CLK_N: U1.AH12(MIPI_TX0_CLKN) ; off-sheet MIPI_TX0_CLK_N
MIPI_TX0_CLK_P: U1.AG12(MIPI_TX0_CLKP) ; off-sheet MIPI_TX0_CLK_P
MIPI_TX0_D0_N: U1.AH15(MIPI_TX0_D0N) ; off-sheet MIPI_TX0_D0_N
MIPI_TX0_D0_P: U1.AG15(MIPI_TX0_D0P) ; off-sheet MIPI_TX0_D0_P
MIPI_TX0_D1_N: U1.AH14(MIPI_TX0_D1N) ; off-sheet MIPI_TX0_D1_N
MIPI_TX0_D1_P: U1.AG14(MIPI_TX0_D1P) ; off-sheet MIPI_TX0_D1_P
MIPI_TX0_D2_N: U1.AH11(MIPI_TX0_D2N) ; off-sheet MIPI_TX0_D2_N
MIPI_TX0_D2_P: U1.AG11(MIPI_TX0_D2P) ; off-sheet MIPI_TX0_D2_P
MIPI_TX0_D3_N: U1.AH9(MIPI_TX0_D3N) ; off-sheet MIPI_TX0_D3_N
MIPI_TX0_D3_P: U1.AG9(MIPI_TX0_D3P) ; off-sheet MIPI_TX0_D3_P
TX0_N: C65.2 U1.A29(EDP_TX0N)
TX0_P: C64.2 U1.B29(EDP_TX0P)
TX1_N: C67.2 U1.A30(EDP_TX1N)
TX1_P: C66.2 U1.B30(EDP_TX1P)
TX2_N: C69.2 U1.C31(EDP_TX2N)
TX2_P: C68.2 U1.C30(EDP_TX2P)
TX3_N: C71.2 U1.D31(EDP_TX3N)
TX3_P: C70.2 U1.D30(EDP_TX3P)
NetR6_1: R6.1 U1.AF15(HDMI_REXT)
NetR7_1: R7.1 U1.G21(EDP_REXT)
NetR8_1: R8.1 U1.AF12(MIPI_TX0_REXT)

Not connected (* = marked no-connect by the designer): U1 G20(EDP_DC_TP)* H21(EDP_CLK24M_IN)*

### Layout directives
net class HDMI SIG. GROUP: HDMI_HPD, HDMI_TX0_N, HDMI_TX0_P, HDMI_TX1_N, HDMI_TX1_P, HDMI_TX2_N, HDMI_TX2_P, HDMI_TXCLK_N, HDMI_TXCLK_P
differential pair; differential pair class DIFF90_EDP: EDP_TX0_N, EDP_TX0_P, EDP_TX1_N, EDP_TX1_P, EDP_TX2_N, EDP_TX2_P, EDP_TX3_N, EDP_TX3_P, EDPAUX_N, EDPAUX_P, TX0_N, TX0_P, TX1_N, TX1_P, TX2_N, TX2_P, TX3_N, TX3_P
net class EDP SIG. GROUP: EDP_TX0_N, EDP_TX0_P, EDP_TX1_N, EDP_TX1_P, EDP_TX2_N, EDP_TX2_P, EDP_TX3_N, EDP_TX3_P, EDPAUX_N, EDPAUX_P, TX0_N, TX0_P, TX1_N, TX1_P, TX2_N, TX2_P, TX3_N, TX3_P
differential pair; differential pair class DIFF100_MIPI-DSI: MIPI_TX0_CLK_N, MIPI_TX0_CLK_P, MIPI_TX0_D0_N, MIPI_TX0_D0_P, MIPI_TX0_D1_N, MIPI_TX0_D1_P, MIPI_TX0_D2_N, MIPI_TX0_D2_P, MIPI_TX0_D3_N, MIPI_TX0_D3_P
net class MIPI-DSI0 SIG. GROUP: MIPI_TX0_CLK_N, MIPI_TX0_CLK_P, MIPI_TX0_D0_N, MIPI_TX0_D0_P, MIPI_TX0_D1_N, MIPI_TX0_D1_P, MIPI_TX0_D2_N, MIPI_TX0_D2_P, MIPI_TX0_D3_N, MIPI_TX0_D3_P
differential pair; differential pair class DIFF100_HDMI: HDMI_TX0_N, HDMI_TX0_P, HDMI_TX1_N, HDMI_TX1_P, HDMI_TX2_N, HDMI_TX2_P, HDMI_TXCLK_N, HDMI_TXCLK_P
net class DIFF_PAIR_CLASS: EDP_TX0_N, EDP_TX0_P, EDP_TX1_N, EDP_TX1_P, EDP_TX2_N, EDP_TX2_P, EDP_TX3_N, EDP_TX3_P, EDPAUX_N, EDPAUX_P, HDMI_TX0_N, HDMI_TX0_P, HDMI_TX1_N, HDMI_TX1_P, HDMI_TX2_N, HDMI_TX2_P, HDMI_TXCLK_N, HDMI_TXCLK_P, MIPI_TX0_CLK_N, MIPI_TX0_CLK_P, MIPI_TX0_D0_N, MIPI_TX0_D0_P, MIPI_TX0_D1_N, MIPI_TX0_D1_P, MIPI_TX0_D2_N, MIPI_TX0_D2_P, MIPI_TX0_D3_N, MIPI_TX0_D3_P

### Notes on the sheet
- Display, HDMI and EDP of CPU
- TITLE:
- DOCUMENT NAME:
- SCALE 1:1
- This document is copyright of EsteemPCB and shall not be revealed, produced, copied, in whole or in part, nor
- PROJECT CODE:
- TEMPLATE:
- A4
- AUTHOR:
- Sheet
- of
- used for any purpose other than submitted.

### Library data of the parts
C64-C71 C73 C74 C76-C78 = CAP_100nF-25V-10%-0201: as C9 on sheet [1]-Power Pins Page of RK3399; Case/Package: 0201; Supplier-1: Digikey
C72 C75 = CAP_1uF-16V-10%-0201: as C8 on sheet [1]-Power Pins Page of RK3399; Case/Package: 0201; Supplier-1: Digikey
D1 = DIO-Z_3.3V-300mW-SOD-523: Zener Diode 3.3V 300mW ±6% Surface Mount SOD-523 /; Manufacturer: Diodes Incorporated; Manufacturer Part Number: BZT52C3V3T-7; Case/Package: SOD523; Supplier-1: Digikey
R5 = RES_10K-0.05W-1%-0201: as R3 on sheet [3]-RK3399_EMMC_ADC_PCIE; Case/Package: 0201; Supplier-1: Digikey
R6 = RES_1.62K-0.05W-1%-0201: 1.62 kOhms ±1% 0.05W, 1/20W Chip Resistor 0201 (0603 Metric) Automotive AEC-Q200 Thick Film /; Manufacturer: Panasonic Electronic Components; Manufacturer Part Number: ERJ-1GNF1621C; Case/Package: 0201; Supplier-1: Digikey
R7 = RES_6.04K-0.05W-1%-0201: 6.04 kOhms ±1% 0.05W, 1/20W Chip Resistor 0201 (0603 Metric) Thick Film /; Manufacturer: Panasonic Electronic Components; Manufacturer Part Number: ERJ-1GEF6041C; Case/Package: 0201; Supplier-1: Digikey
R8 = RES_4.02K-0.05W-1%-0201: 4.02 kOhms ±1% 0.05W, 1/20W Chip Resistor 0201 (0603 Metric) Thick Film /; Manufacturer: Yageo; Manufacturer Part Number: RC0201FR-074K02L; Case/Package: 0201; Supplier-1: Digikey
U1 = IC_RK3399-FCBGA828: as U1 on sheet [1]-Power Pins Page of RK3399; Manufacturer Part Number: RK3399; Case/Package: FCBGA828; Supplier-1: Rockchip

## Sheet [5]-USB2, TYPEC, USIC.SchDoc: RK3399 SOM Board Design V1.0
size A4; Author: AVIRAL MISHRA; DocumentNumber: 7; SheetNumber: 7; SheetTotal: 21; PROJECT CODE: A_V1.0
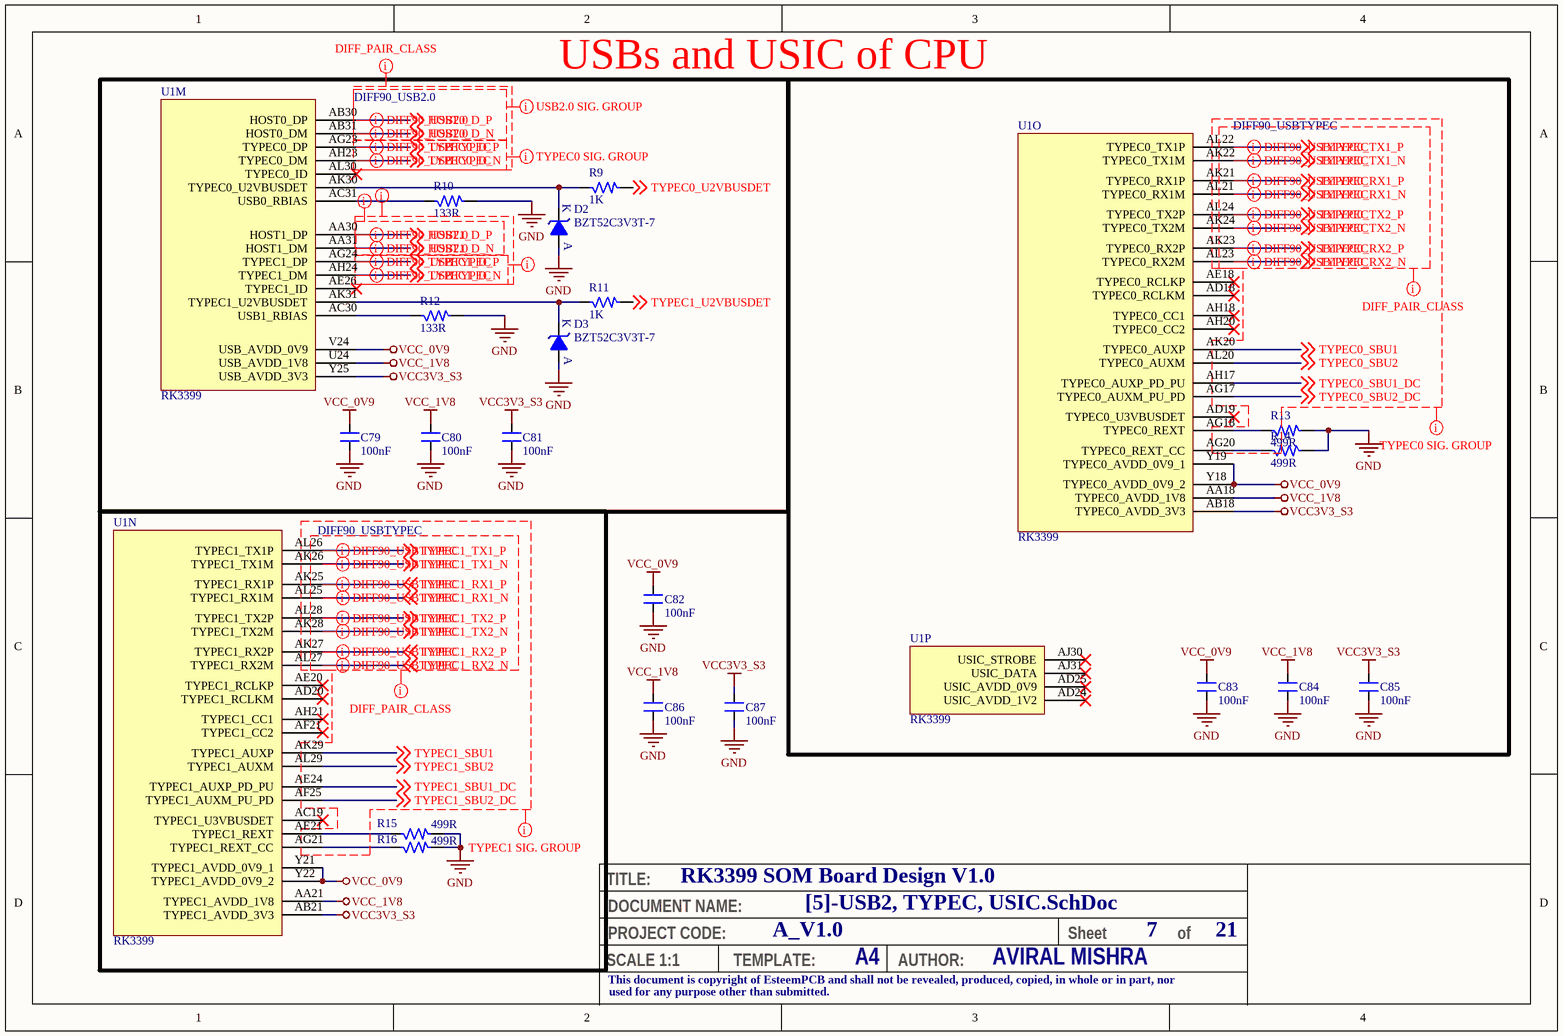
[diagram p6: [5]-USB2, TYPEC, USIC.SchDoc]

### Parts
C79  100nF  [CAP_0201]
C80  100nF  [CAP_0201]
C81  100nF  [CAP_0201]
C82  100nF  [CAP_0201]
C83  100nF  [CAP_0201]
C84  100nF  [CAP_0201]
C85  100nF  [CAP_0201]
C86  100nF  [CAP_0201]
C87  100nF  [CAP_0201]
D2  BZT52C3V3T-7  [DIO_SOD523]
D3  BZT52C3V3T-7  [DIO_SOD523]
R9  1K  [RES_0201]
R10  133R  [RES_0201]
R11  1K  [RES_0201]
R12  133R  [RES_0201]
R13  499R  [RES_0201]
R14  499R  [RES_0201]
R15  499R  [RES_0201]
R16  499R  [RES_0201]
U1  RK3399  [FBGA828_23_826X826]  (parts M,N,O,P of 24)

### Blocks framed on the sheet
USBs and USIC of CPU: C79-C81 D2 D3 R9-R12 U1

### Nets
GND: C79.2 C80.1 C81.1 C82.1 C83.1 C84.1 C85.1 C86.1 C87.1 D2.A D3.A R10.2 R12.2 R13.2 R14.2 R15.2 R16.2
VCC3V3_S3: C81.2 C85.2 C87.2 U1.AB18(TYPEC0_AVDD_3V3) U1.AB21(TYPEC1_AVDD_3V3) U1.Y25(USB_AVDD_3V3)
VCC_0V9: C79.1 C82.2 C83.2 U1.V24(USB_AVDD_0V9) U1.Y18(TYPEC0_AVDD_0V9_2) U1.Y19(TYPEC0_AVDD_0V9_1) U1.Y21(TYPEC1_AVDD_0V9_1) U1.Y22(TYPEC1_AVDD_0V9_2)
VCC_1V8: C80.2 C84.2 C86.2 U1.AA18(TYPEC0_AVDD_1V8) U1.AA21(TYPEC1_AVDD_1V8) U1.U24(USB_AVDD_1V8)
HOST0_D_N: U1.AB31(HOST0_DM) ; off-sheet HOST0_D_N
HOST0_D_P: U1.AB30(HOST0_DP) ; off-sheet HOST0_D_P
HOST1_D_N: U1.AA31(HOST1_DM) ; off-sheet HOST1_D_N
HOST1_D_P: U1.AA30(HOST1_DP) ; off-sheet HOST1_D_P
TYPEC0_D_N: U1.AH23(TYPEC0_DM) ; off-sheet TYPEC0_D_N
TYPEC0_D_P: U1.AG23(TYPEC0_DP) ; off-sheet TYPEC0_D_P
TYPEC0_RX1_N: U1.AL21(TYPEC0_RX1M) ; off-sheet TYPEC0_RX1_N
TYPEC0_RX1_P: U1.AK21(TYPEC0_RX1P) ; off-sheet TYPEC0_RX1_P
TYPEC0_RX2_N: U1.AL23(TYPEC0_RX2M) ; off-sheet TYPEC0_RX2_N
TYPEC0_RX2_P: U1.AK23(TYPEC0_RX2P) ; off-sheet TYPEC0_RX2_P
TYPEC0_SBU1: U1.AK20(TYPEC0_AUXP) ; off-sheet TYPEC0_SBU1
TYPEC0_SBU1_DC: U1.AH17(TYPEC0_AUXP_PD_PU) ; off-sheet TYPEC0_SBU1_DC
TYPEC0_SBU2: U1.AL20(TYPEC0_AUXM) ; off-sheet TYPEC0_SBU2
TYPEC0_SBU2_DC: U1.AG17(TYPEC0_AUXM_PU_PD) ; off-sheet TYPEC0_SBU2_DC
TYPEC0_TX1_N: U1.AK22(TYPEC0_TX1M) ; off-sheet TYPEC0_TX1_N
TYPEC0_TX1_P: U1.AL22(TYPEC0_TX1P) ; off-sheet TYPEC0_TX1_P
TYPEC0_TX2_N: U1.AK24(TYPEC0_TX2M) ; off-sheet TYPEC0_TX2_N
TYPEC0_TX2_P: U1.AL24(TYPEC0_TX2P) ; off-sheet TYPEC0_TX2_P
TYPEC0_U2VBUSDET: R9.2 ; off-sheet TYPEC0_U2VBUSDET
TYPEC1_D_N: U1.AH24(TYPEC1_DM) ; off-sheet TYPEC1_D_N
TYPEC1_D_P: U1.AG24(TYPEC1_DP) ; off-sheet TYPEC1_D_P
TYPEC1_RX1_N: U1.AL25(TYPEC1_RX1M) ; off-sheet TYPEC1_RX1_N
TYPEC1_RX1_P: U1.AK25(TYPEC1_RX1P) ; off-sheet TYPEC1_RX1_P
TYPEC1_RX2_N: U1.AL27(TYPEC1_RX2M) ; off-sheet TYPEC1_RX2_N
TYPEC1_RX2_P: U1.AK27(TYPEC1_RX2P) ; off-sheet TYPEC1_RX2_P
TYPEC1_SBU1: U1.AK29(TYPEC1_AUXP) ; off-sheet TYPEC1_SBU1
TYPEC1_SBU1_DC: U1.AE24(TYPEC1_AUXP_PD_PU) ; off-sheet TYPEC1_SBU1_DC
TYPEC1_SBU2: U1.AL29(TYPEC1_AUXM) ; off-sheet TYPEC1_SBU2
TYPEC1_SBU2_DC: U1.AF25(TYPEC1_AUXM_PU_PD) ; off-sheet TYPEC1_SBU2_DC
TYPEC1_TX1_N: U1.AK26(TYPEC1_TX1M) ; off-sheet TYPEC1_TX1_N
TYPEC1_TX1_P: U1.AL26(TYPEC1_TX1P) ; off-sheet TYPEC1_TX1_P
TYPEC1_TX2_N: U1.AK28(TYPEC1_TX2M) ; off-sheet TYPEC1_TX2_N
TYPEC1_TX2_P: U1.AL28(TYPEC1_TX2P) ; off-sheet TYPEC1_TX2_P
TYPEC1_U2VBUSDET: R11.2 ; off-sheet TYPEC1_U2VBUSDET
NetD2_K: D2.K R9.1 U1.AK30(TYPEC0_U2VBUSDET)
NetD3_K: D3.K R11.1 U1.AK31(TYPEC1_U2VBUSDET)
NetR10_1: R10.1 U1.AC31(USB0_RBIAS)
NetR12_1: R12.1 U1.AC30(USB1_RBIAS)
NetR13_1: R13.1 U1.AG18(TYPEC0_REXT)
NetR14_1: R14.1 U1.AG20(TYPEC0_REXT_CC)
NetR15_1: R15.1 U1.AE21(TYPEC1_REXT)
NetR16_1: R16.1 U1.AG21(TYPEC1_REXT_CC)

Not connected (* = marked no-connect by the designer): U1 AC19(TYPEC1_U3VBUSDET)* AD18(TYPEC0_RCLKM)* AD19(TYPEC0_U3VBUSDET)* AD20(TYPEC1_RCLKM)* AD24(USIC_AVDD_1V2)* AD25(USIC_AVDD_0V9)* AE18(TYPEC0_RCLKP)* AE20(TYPEC1_RCLKP)* AE26(TYPEC1_ID)* AF21(TYPEC1_CC2)* AH18(TYPEC0_CC1)* AH20(TYPEC0_CC2)* AH21(TYPEC1_CC1)* AJ30(USIC_STROBE)* AJ31(USIC_DATA)* AL30(TYPEC0_ID)*

### Layout directives
differential pair; differential pair class DIFF90_USB2.0: HOST0_D_N, HOST0_D_P, HOST1_D_N, HOST1_D_P
net class USB2.0 SIG. GROUP: HOST0_D_N, HOST0_D_P, HOST1_D_N, HOST1_D_P
differential pair; differential pair class DIFF90_USBTYPEC: TYPEC0_D_N, TYPEC0_D_P, TYPEC0_RX1_N, TYPEC0_RX1_P, TYPEC0_RX2_N, TYPEC0_RX2_P, TYPEC0_TX1_N, TYPEC0_TX1_P, TYPEC0_TX2_N, TYPEC0_TX2_P, TYPEC1_D_N, TYPEC1_D_P, TYPEC1_RX1_N, TYPEC1_RX1_P, TYPEC1_RX2_N, TYPEC1_RX2_P, TYPEC1_TX1_N, TYPEC1_TX1_P, TYPEC1_TX2_N, TYPEC1_TX2_P
net class TYPEC1 SIG. GROUP: TYPEC1_D_N, TYPEC1_D_P, TYPEC1_RX1_N, TYPEC1_RX1_P, TYPEC1_RX2_N, TYPEC1_RX2_P, TYPEC1_SBU1, TYPEC1_SBU1_DC, TYPEC1_SBU2, TYPEC1_SBU2_DC, TYPEC1_TX1_N, TYPEC1_TX1_P, TYPEC1_TX2_N, TYPEC1_TX2_P
net class TYPEC0 SIG. GROUP: TYPEC0_D_N, TYPEC0_D_P, TYPEC0_RX1_N, TYPEC0_RX1_P, TYPEC0_RX2_N, TYPEC0_RX2_P, TYPEC0_SBU1, TYPEC0_SBU1_DC, TYPEC0_SBU2, TYPEC0_SBU2_DC, TYPEC0_TX1_N, TYPEC0_TX1_P, TYPEC0_TX2_N, TYPEC0_TX2_P
net class DIFF_PAIR_CLASS: HOST0_D_N, HOST0_D_P, HOST1_D_N, HOST1_D_P, TYPEC0_D_N, TYPEC0_D_P, TYPEC0_RX1_N, TYPEC0_RX1_P, TYPEC0_RX2_N, TYPEC0_RX2_P, TYPEC0_TX1_N, TYPEC0_TX1_P, TYPEC0_TX2_N, TYPEC0_TX2_P, TYPEC1_D_N, TYPEC1_D_P, TYPEC1_RX1_N, TYPEC1_RX1_P, TYPEC1_RX2_N, TYPEC1_RX2_P, TYPEC1_TX1_N, TYPEC1_TX1_P, TYPEC1_TX2_N, TYPEC1_TX2_P

### Notes on the sheet
- TITLE:
- DOCUMENT NAME:
- SCALE 1:1
- This document is copyright of EsteemPCB and shall not be revealed, produced, copied, in whole or in part, nor
- PROJECT CODE:
- TEMPLATE:
- A4
- AUTHOR:
- Sheet
- of
- used for any purpose other than submitted.

### Library data of the parts
C79-C87 = CAP_100nF-25V-10%-0201: as C9 on sheet [1]-Power Pins Page of RK3399; Case/Package: 0201; Supplier-1: Digikey
D2 D3 = DIO-Z_3.3V-300mW-SOD-523: as D1 on sheet [4]-RK3399 EDP_CSI_HDMI; Manufacturer Part Number: BZT52C3V3T-7; Case/Package: SOD523; Supplier-1: Digikey
R9 R11 = RES_1K-0.05W-1%-0201: as R78 on sheet [2]-PMUIO_BLOCK; Case/Package: 0201; Supplier-1: Digikey
R10 R12 = RES_133R-0.05W-1%-0201: 133 Ohms ±1% 0.05W, 1/20W Chip Resistor 0201 (0603 Metric) Automotive AEC-Q200 Thick Film /; Manufacturer: Panasonic Electronic Components; Manufacturer Part Number: ERJ-1GNF1330C; Case/Package: 0201; Supplier-1: Digikey
R13-R16 = RES_499R-0.05W-1%-0201: 499 Ohms ±1% 0.05W, 1/20W Chip Resistor 0201 (0603 Metric) Thick Film /; Manufacturer: Stackpole Electronics Inc; Manufacturer Part Number: RMCF0201FT499R; Case/Package: 0201; Supplier-1: Digikey
U1 = IC_RK3399-FCBGA828: as U1 on sheet [1]-Power Pins Page of RK3399; Manufacturer Part Number: RK3399; Case/Package: FCBGA828; Supplier-1: Rockchip

## Sheet [6]-MIPI-CSI_GPIOs and I2C.SchDoc: RK3399 SOM Board Design V1.0
size A4; Author: AVIRAL MISHRA; DocumentNumber: 8; SheetNumber: 8; SheetTotal: 21; PROJECT CODE: A_V1.0
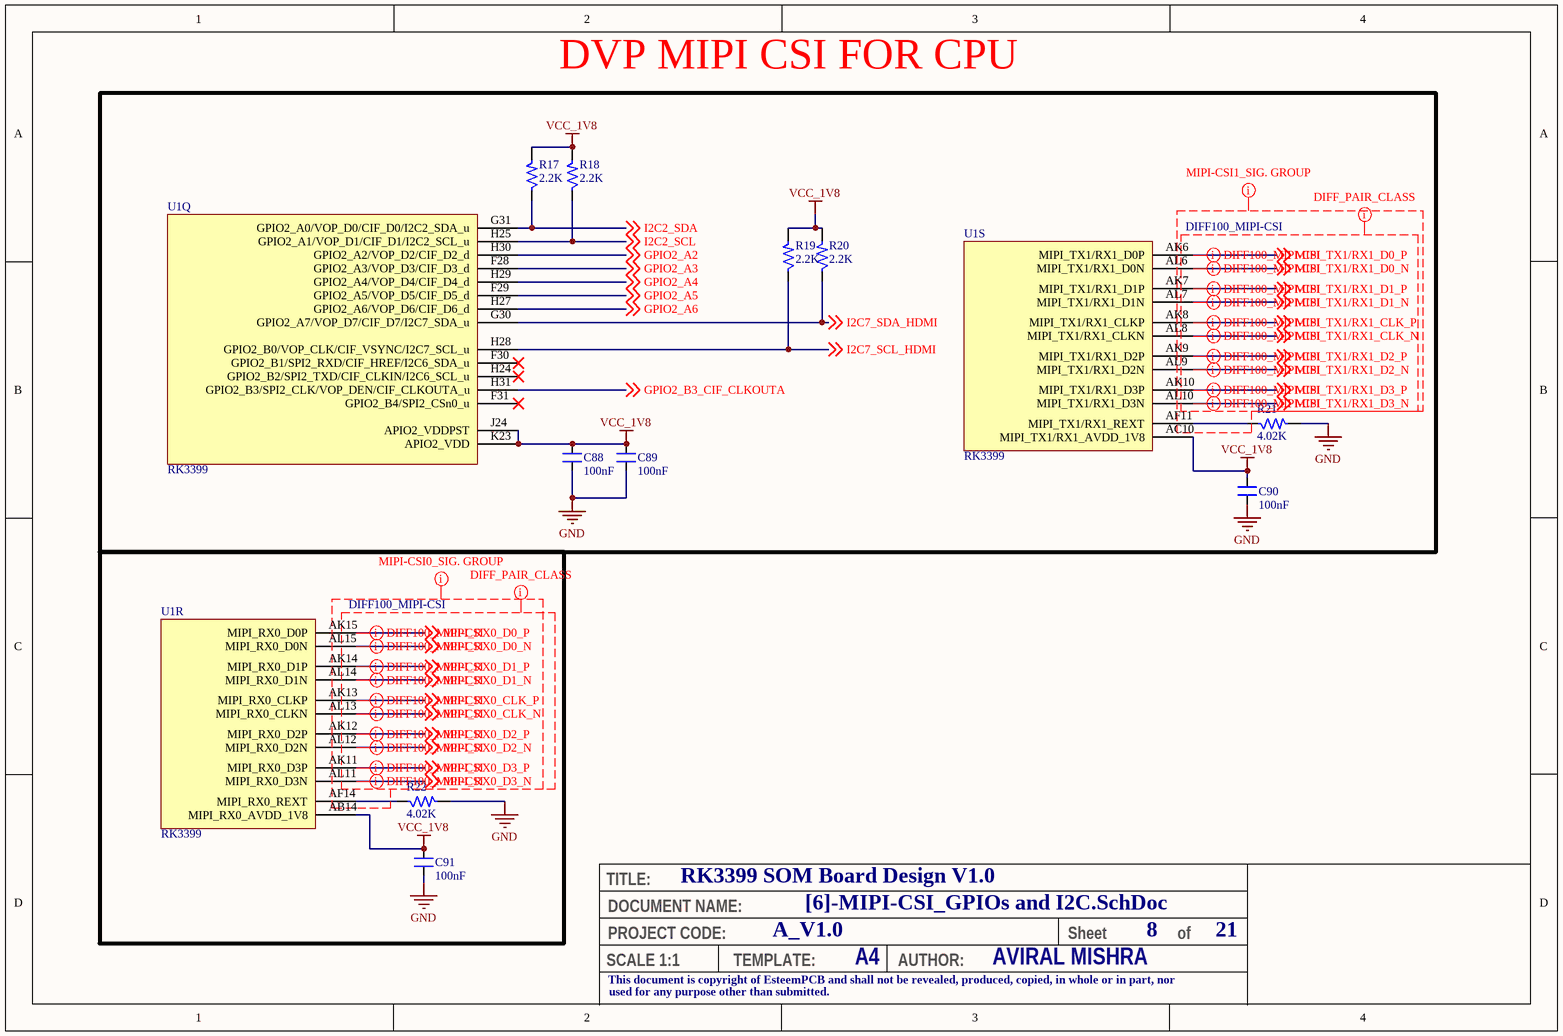
[diagram p7: [6]-MIPI-CSI_GPIOs and I2C.SchDoc]

### Parts
C88  100nF  [CAP_0201]
C89  100nF  [CAP_0201]
C90  100nF  [CAP_0201]
C91  100nF  [CAP_0201]
R17  2.2K  [RES_0201]
R18  2.2K  [RES_0201]
R19  2.2K  [RES_0201]
R20  2.2K  [RES_0201]
R21  4.02K  [RES_0201]
R22  4.02K  [RES_0201]
U1  RK3399  [FBGA828_23_826X826]  (parts Q,R,S of 24)

### Blocks framed on the sheet
DVP MIPI CSI FOR CPU: C88-C90 R17-R21 U1

### Nets
GND: C88.1 C89.1 C90.1 C91.1 R21.2 R22.2
VCC_1V8: C88.2 C89.2 C90.2 C91.2 R17.2 R18.2 R19.2 R20.2 U1.AB14(MIPI_RX0_AVDD_1V8) U1.AC10(MIPI_TX1/RX1_AVDD_1V8) U1.J24(APIO2_VDDPST) U1.K23(APIO2_VDD)
GPIO2_A2: U1.H30(GPIO2_A2/VOP_D2/CIF_D2_d) ; off-sheet GPIO2_A2
GPIO2_A3: U1.F28(GPIO2_A3/VOP_D3/CIF_D3_d) ; off-sheet GPIO2_A3
GPIO2_A4: U1.H29(GPIO2_A4/VOP_D4/CIF_D4_d) ; off-sheet GPIO2_A4
GPIO2_A5: U1.F29(GPIO2_A5/VOP_D5/CIF_D5_d) ; off-sheet GPIO2_A5
GPIO2_A6: U1.H27(GPIO2_A6/VOP_D6/CIF_D6_d) ; off-sheet GPIO2_A6
GPIO2_B3_CIF_CLKOUTA: U1.H31(GPIO2_B3/SPI2_CLK/VOP_DEN/CIF_CLKOUTA_u) ; off-sheet GPIO2_B3_CIF_CLKOUTA
I2C2_SCL: R18.1 U1.H25(GPIO2_A1/VOP_D1/CIF_D1/I2C2_SCL_u) ; off-sheet I2C2_SCL
I2C2_SDA: R17.1 U1.G31(GPIO2_A0/VOP_D0/CIF_D0/I2C2_SDA_u) ; off-sheet I2C2_SDA
I2C7_SCL_HDMI: R19.1 U1.H28(GPIO2_B0/VOP_CLK/CIF_VSYNC/I2C7_SCL_u) ; off-sheet I2C7_SCL_HDMI
I2C7_SDA_HDMI: R20.1 U1.G30(GPIO2_A7/VOP_D7/CIF_D7/I2C7_SDA_u) ; off-sheet I2C7_SDA_HDMI
MIPI_RX0_CLK_N: U1.AL13(MIPI_RX0_CLKN) ; off-sheet MIPI_RX0_CLK_N
MIPI_RX0_CLK_P: U1.AK13(MIPI_RX0_CLKP) ; off-sheet MIPI_RX0_CLK_P
MIPI_RX0_D0_N: U1.AL15(MIPI_RX0_D0N) ; off-sheet MIPI_RX0_D0_N
MIPI_RX0_D0_P: U1.AK15(MIPI_RX0_D0P) ; off-sheet MIPI_RX0_D0_P
MIPI_RX0_D1_N: U1.AL14(MIPI_RX0_D1N) ; off-sheet MIPI_RX0_D1_N
MIPI_RX0_D1_P: U1.AK14(MIPI_RX0_D1P) ; off-sheet MIPI_RX0_D1_P
MIPI_RX0_D2_N: U1.AL12(MIPI_RX0_D2N) ; off-sheet MIPI_RX0_D2_N
MIPI_RX0_D2_P: U1.AK12(MIPI_RX0_D2P) ; off-sheet MIPI_RX0_D2_P
MIPI_RX0_D3_N: U1.AL11(MIPI_RX0_D3N) ; off-sheet MIPI_RX0_D3_N
MIPI_RX0_D3_P: U1.AK11(MIPI_RX0_D3P) ; off-sheet MIPI_RX0_D3_P
MIPI_TX1/RX1_CLK_N: U1.AL8(MIPI_TX1/RX1_CLKN) ; off-sheet MIPI_TX1/RX1_CLK_N
MIPI_TX1/RX1_CLK_P: U1.AK8(MIPI_TX1/RX1_CLKP) ; off-sheet MIPI_TX1/RX1_CLK_P
MIPI_TX1/RX1_D0_N: U1.AL6(MIPI_TX1/RX1_D0N) ; off-sheet MIPI_TX1/RX1_D0_N
MIPI_TX1/RX1_D0_P: U1.AK6(MIPI_TX1/RX1_D0P) ; off-sheet MIPI_TX1/RX1_D0_P
MIPI_TX1/RX1_D1_N: U1.AL7(MIPI_TX1/RX1_D1N) ; off-sheet MIPI_TX1/RX1_D1_N
MIPI_TX1/RX1_D1_P: U1.AK7(MIPI_TX1/RX1_D1P) ; off-sheet MIPI_TX1/RX1_D1_P
MIPI_TX1/RX1_D2_N: U1.AL9(MIPI_TX1/RX1_D2N) ; off-sheet MIPI_TX1/RX1_D2_N
MIPI_TX1/RX1_D2_P: U1.AK9(MIPI_TX1/RX1_D2P) ; off-sheet MIPI_TX1/RX1_D2_P
MIPI_TX1/RX1_D3_N: U1.AL10(MIPI_TX1/RX1_D3N) ; off-sheet MIPI_TX1/RX1_D3_N
MIPI_TX1/RX1_D3_P: U1.AK10(MIPI_TX1/RX1_D3P) ; off-sheet MIPI_TX1/RX1_D3_P
NetR21_1: R21.1 U1.AF11(MIPI_TX1/RX1_REXT)
NetR22_1: R22.1 U1.AF14(MIPI_RX0_REXT)

Not connected (* = marked no-connect by the designer): U1 F30(GPIO2_B1/SPI2_RXD/CIF_HREF/I2C6_SDA_u)* F31(GPIO2_B4/SPI2_CSn0_u)* H24(GPIO2_B2/SPI2_TXD/CIF_CLKIN/I2C6_SCL_u)*

### Layout directives
net class MIPI-CSI1_SIG. GROUP: MIPI_TX1/RX1_CLK_N, MIPI_TX1/RX1_CLK_P, MIPI_TX1/RX1_D0_N, MIPI_TX1/RX1_D0_P, MIPI_TX1/RX1_D1_N, MIPI_TX1/RX1_D1_P, MIPI_TX1/RX1_D2_N, MIPI_TX1/RX1_D2_P, MIPI_TX1/RX1_D3_N, MIPI_TX1/RX1_D3_P
net class MIPI-CSI0_SIG. GROUP: MIPI_RX0_CLK_N, MIPI_RX0_CLK_P, MIPI_RX0_D0_N, MIPI_RX0_D0_P, MIPI_RX0_D1_N, MIPI_RX0_D1_P, MIPI_RX0_D2_N, MIPI_RX0_D2_P, MIPI_RX0_D3_N, MIPI_RX0_D3_P
differential pair; differential pair class DIFF100_MIPI-CSI: MIPI_RX0_CLK_N, MIPI_RX0_CLK_P, MIPI_RX0_D0_N, MIPI_RX0_D0_P, MIPI_RX0_D1_N, MIPI_RX0_D1_P, MIPI_RX0_D2_N, MIPI_RX0_D2_P, MIPI_RX0_D3_N, MIPI_RX0_D3_P, MIPI_TX1/RX1_CLK_N, MIPI_TX1/RX1_CLK_P, MIPI_TX1/RX1_D0_N, MIPI_TX1/RX1_D0_P, MIPI_TX1/RX1_D1_N, MIPI_TX1/RX1_D1_P, MIPI_TX1/RX1_D2_N, MIPI_TX1/RX1_D2_P, MIPI_TX1/RX1_D3_N, MIPI_TX1/RX1_D3_P
net class DIFF_PAIR_CLASS: MIPI_RX0_CLK_N, MIPI_RX0_CLK_P, MIPI_RX0_D0_N, MIPI_RX0_D0_P, MIPI_RX0_D1_N, MIPI_RX0_D1_P, MIPI_RX0_D2_N, MIPI_RX0_D2_P, MIPI_RX0_D3_N, MIPI_RX0_D3_P, MIPI_TX1/RX1_CLK_N, MIPI_TX1/RX1_CLK_P, MIPI_TX1/RX1_D0_N, MIPI_TX1/RX1_D0_P, MIPI_TX1/RX1_D1_N, MIPI_TX1/RX1_D1_P, MIPI_TX1/RX1_D2_N, MIPI_TX1/RX1_D2_P, MIPI_TX1/RX1_D3_N, MIPI_TX1/RX1_D3_P

### Notes on the sheet
- TITLE:
- DOCUMENT NAME:
- SCALE 1:1
- This document is copyright of EsteemPCB and shall not be revealed, produced, copied, in whole or in part, nor
- PROJECT CODE:
- TEMPLATE:
- A4
- AUTHOR:
- Sheet
- of
- used for any purpose other than submitted.

### Library data of the parts
C88-C91 = CAP_100nF-25V-10%-0201: as C9 on sheet [1]-Power Pins Page of RK3399; Case/Package: 0201; Supplier-1: Digikey
R17-R20 = RES_2.2K-0.05W-1%-0201: 2.2 kOhms ±1% 0.05W, 1/20W Chip Resistor 0201 (0603 Metric) Thick Film /; Manufacturer: Stackpole Electronics Inc; Manufacturer Part Number: RMCF0201FT2K20; Case/Package: 0201; Supplier-1: Digikey
R21 R22 = RES_4.02K-0.05W-1%-0201: as R8 on sheet [4]-RK3399 EDP_CSI_HDMI; Case/Package: 0201; Supplier-1: Digikey
U1 = IC_RK3399-FCBGA828: as U1 on sheet [1]-Power Pins Page of RK3399; Manufacturer Part Number: RK3399; Case/Package: FCBGA828; Supplier-1: Rockchip